# EAGLE board 8B_RAM_3 (EAGLE 6.5.0), part 1 of 3
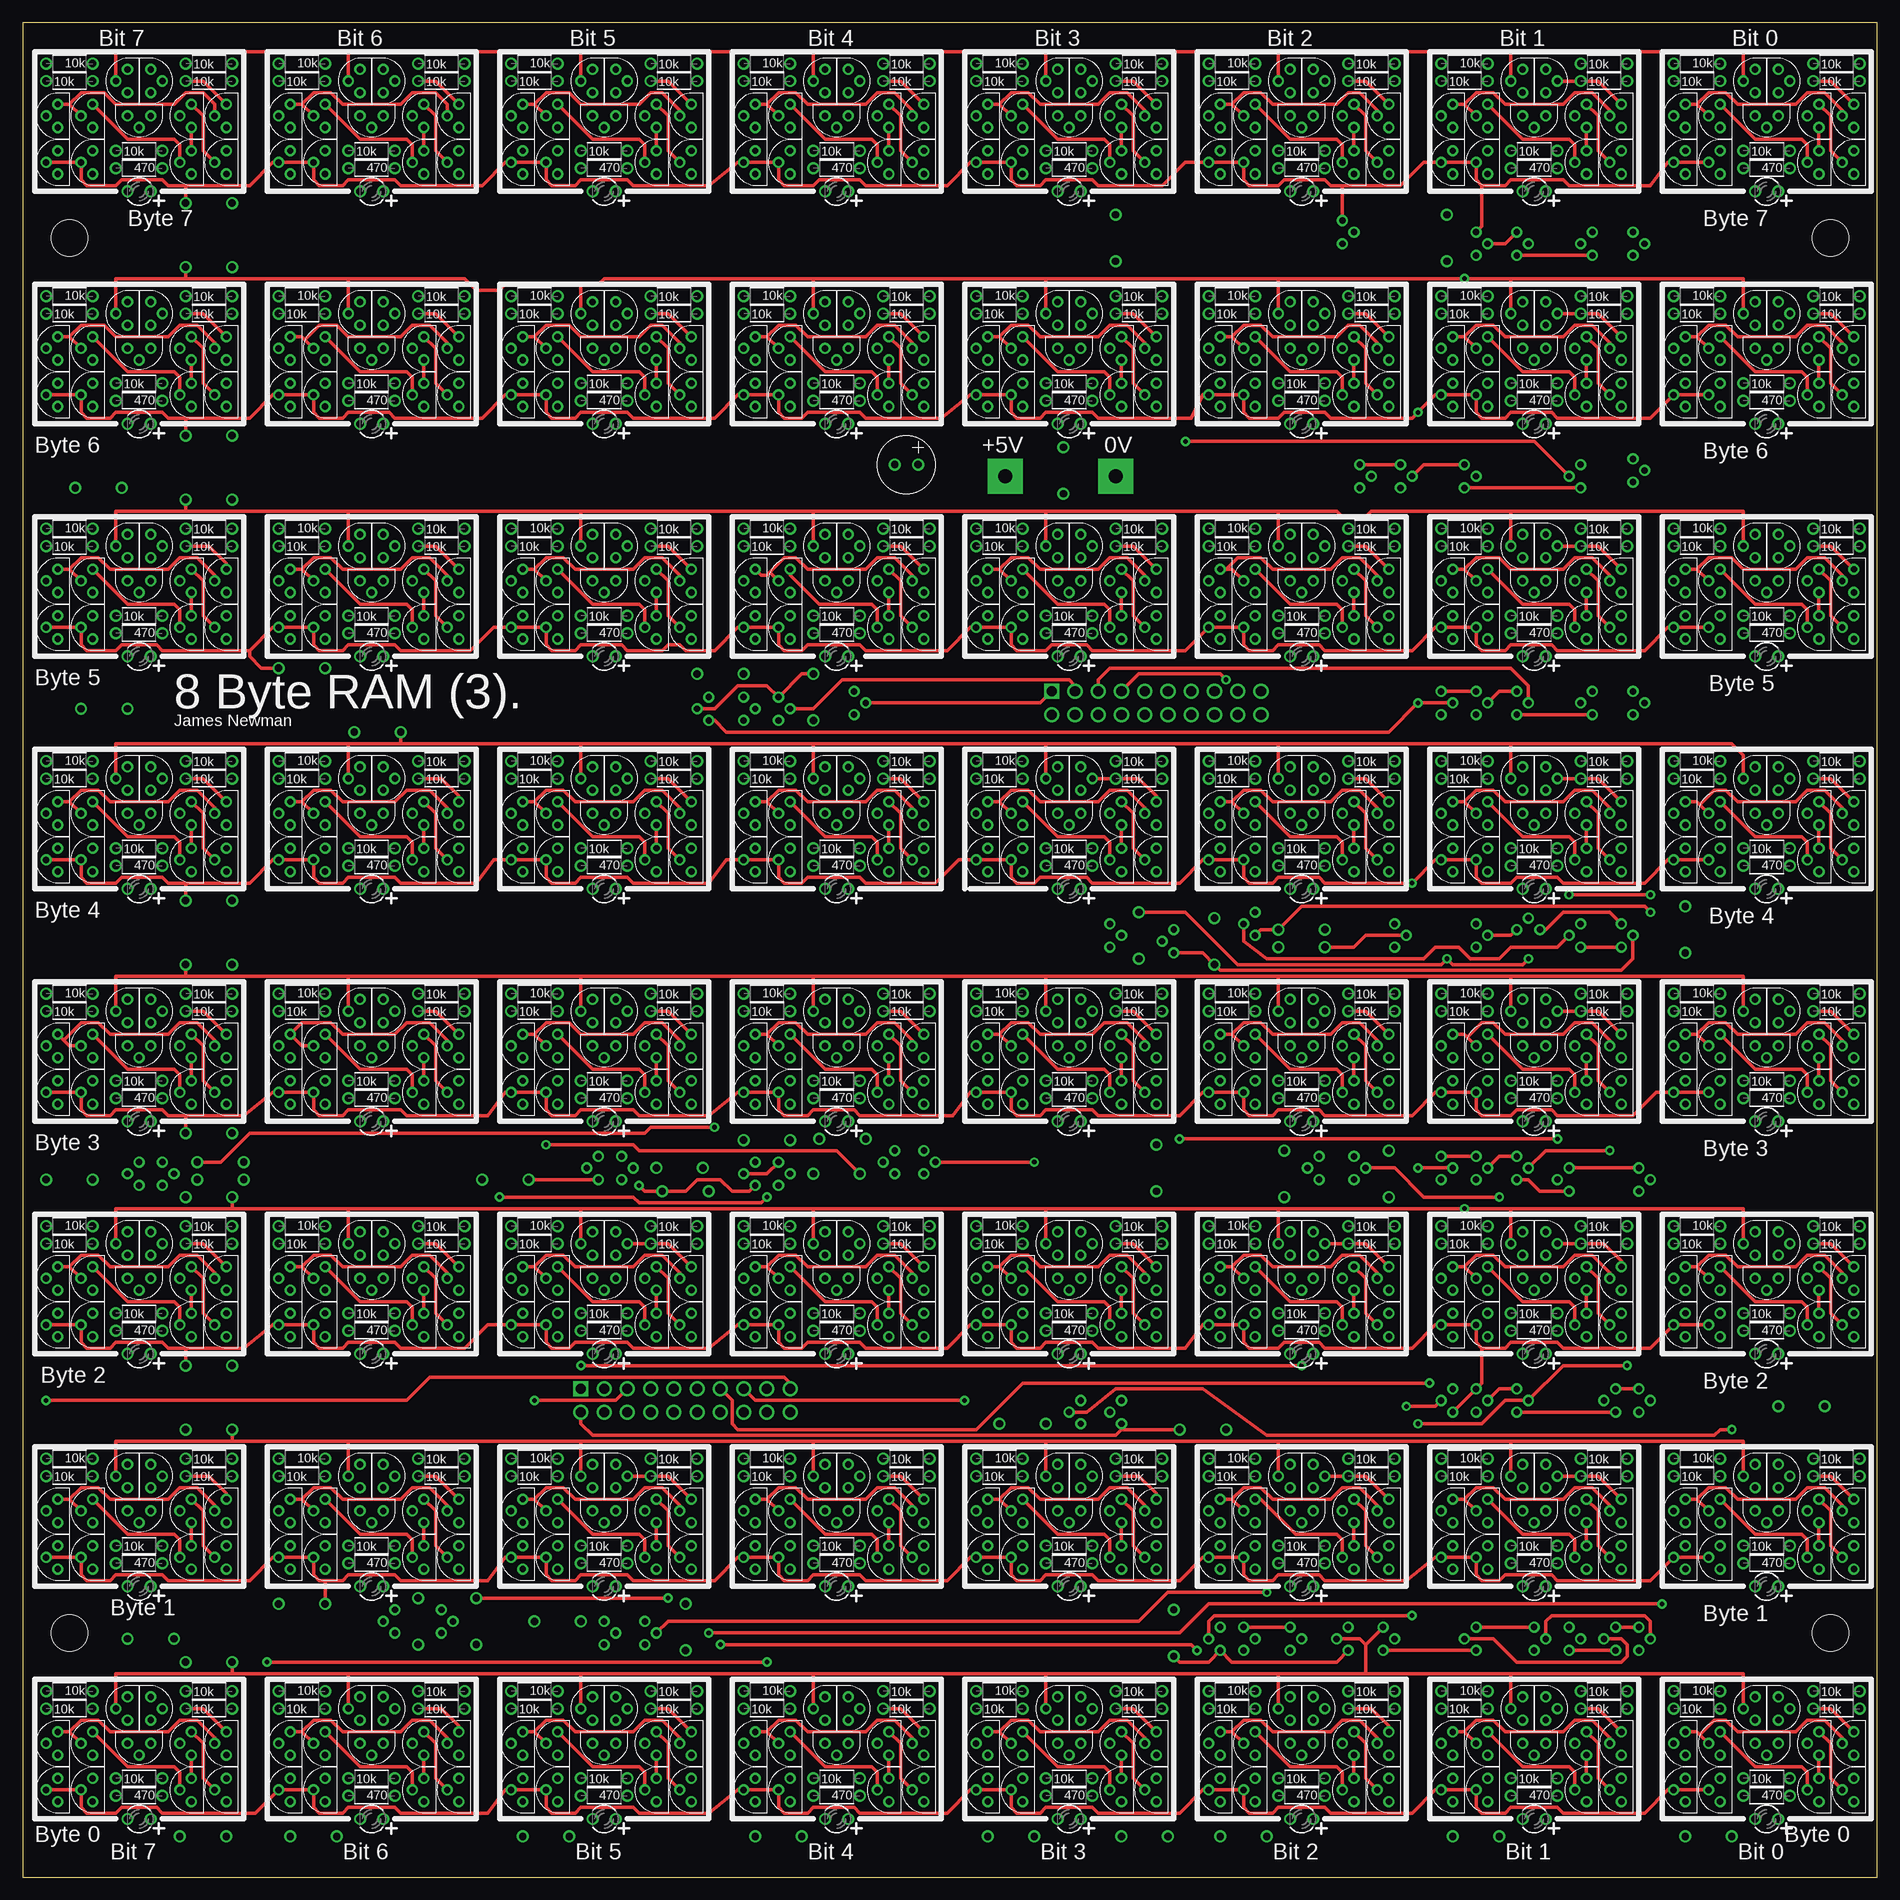
[diagram p44: board, top side]
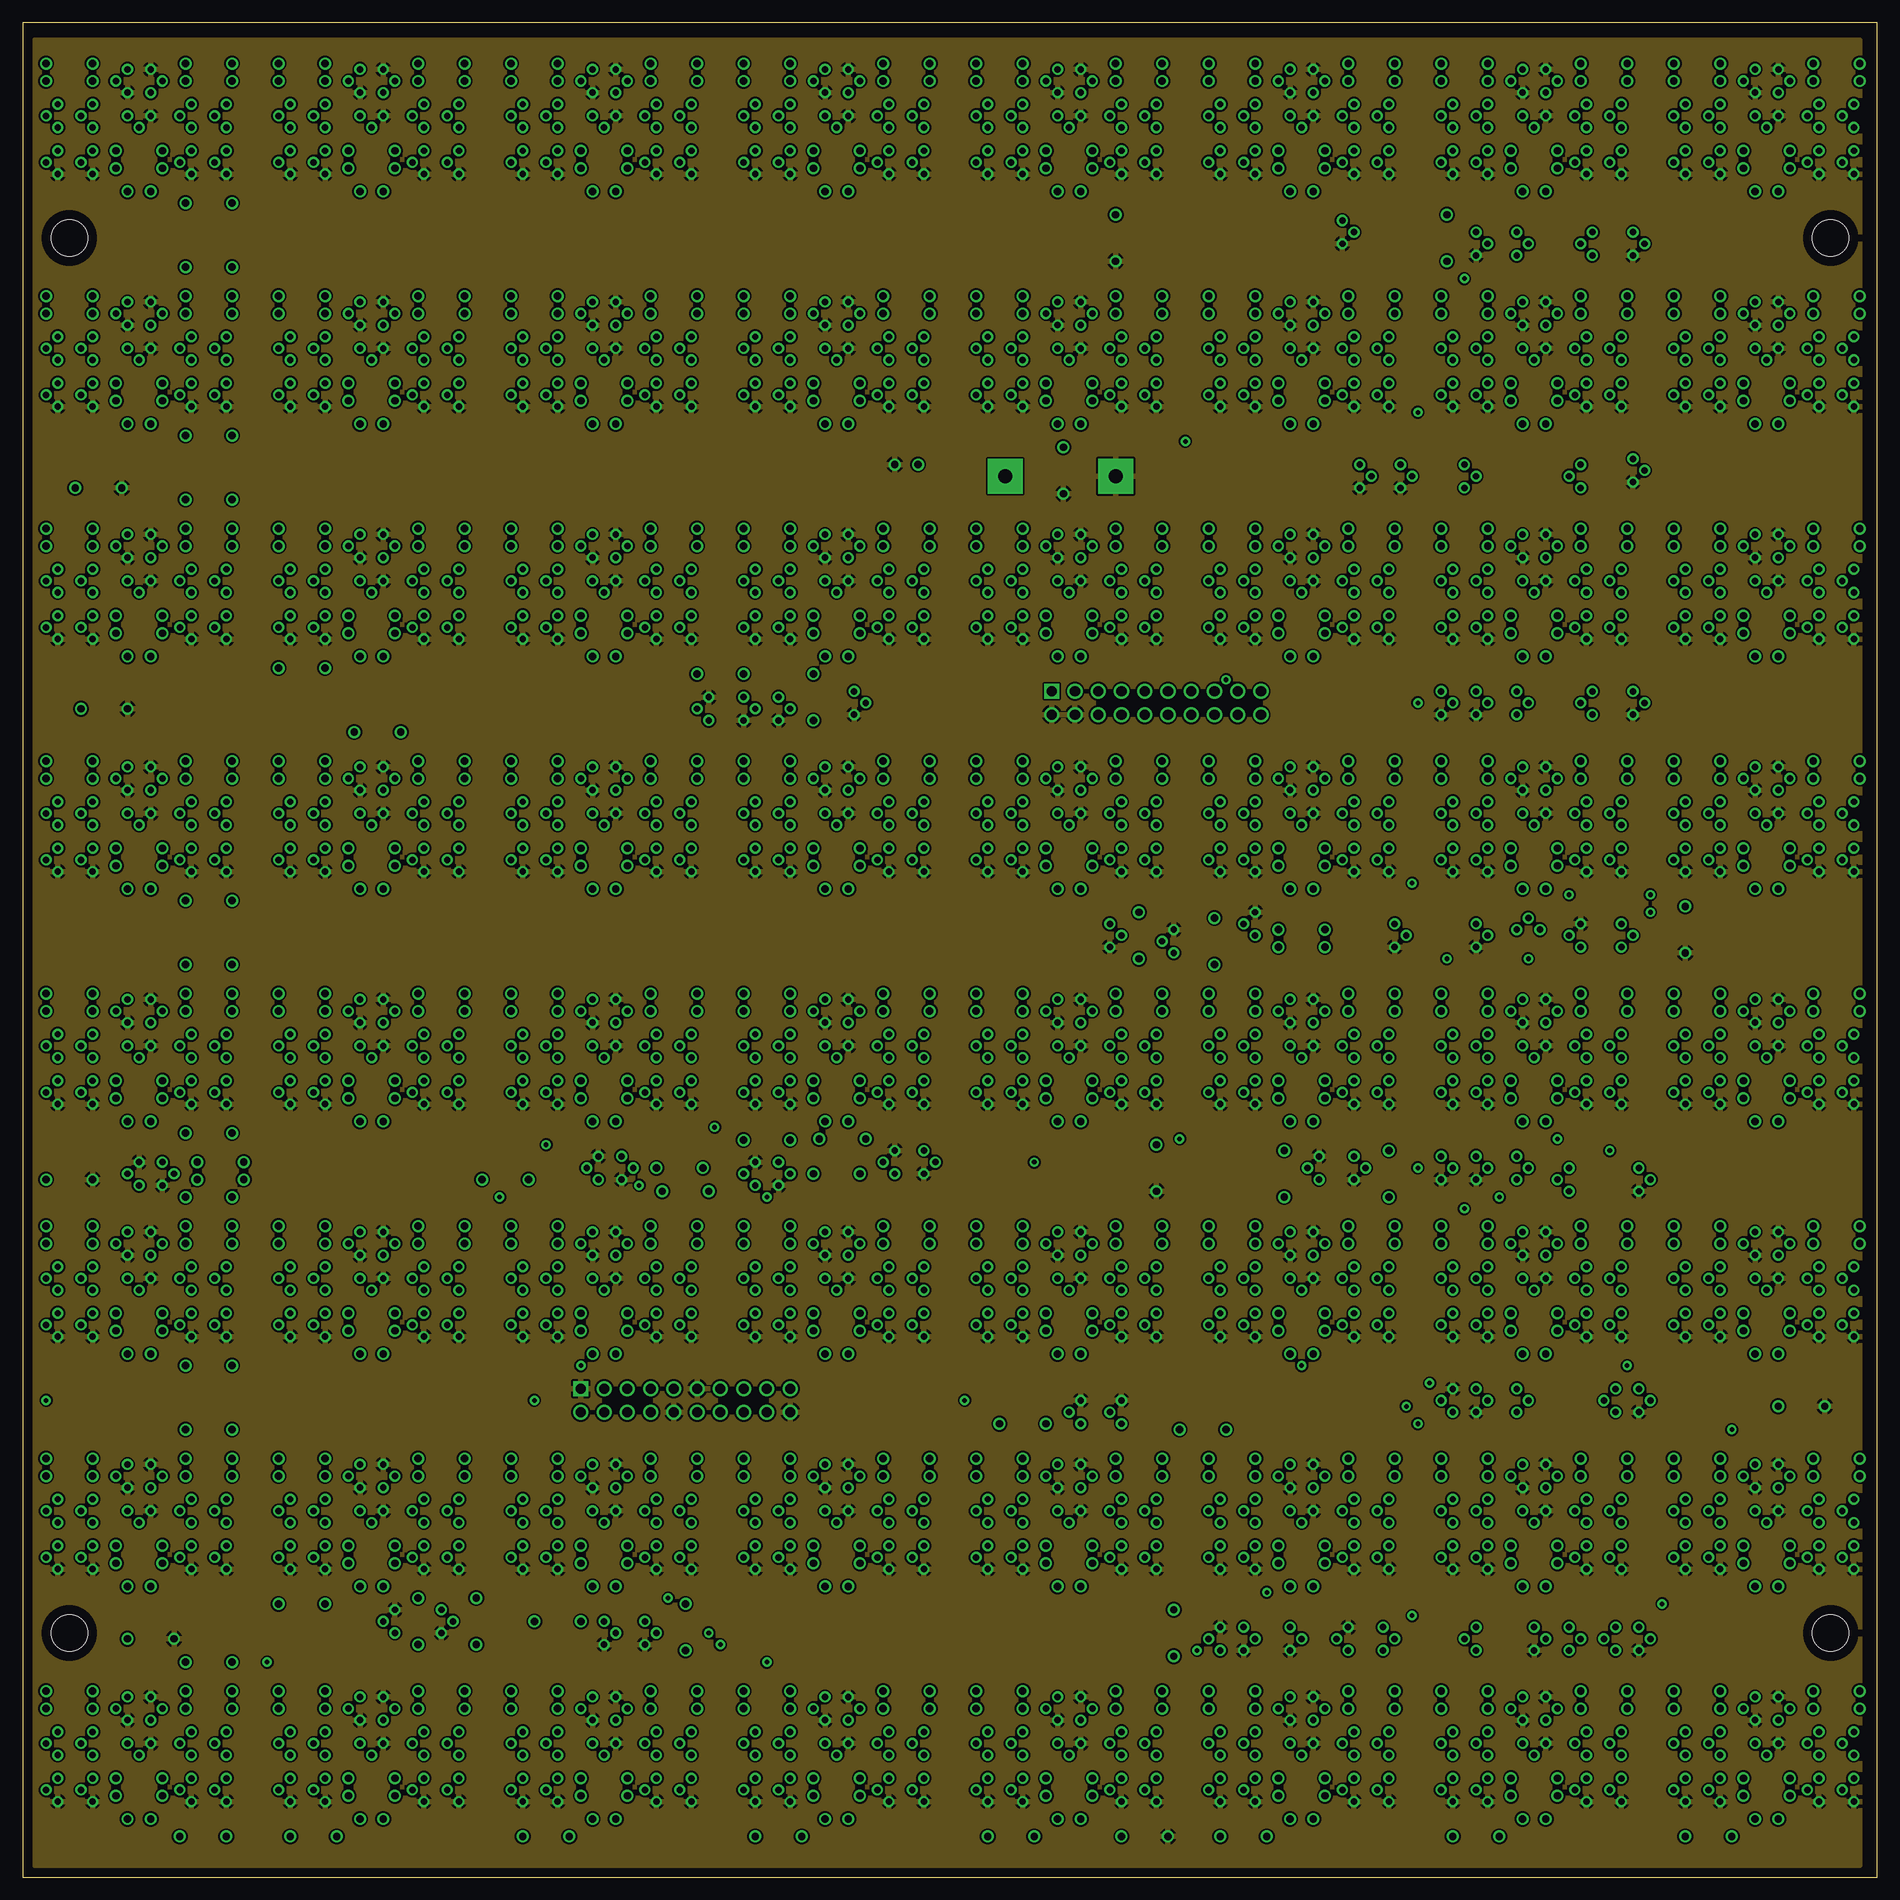
[diagram p45: board, inner layer Route2]
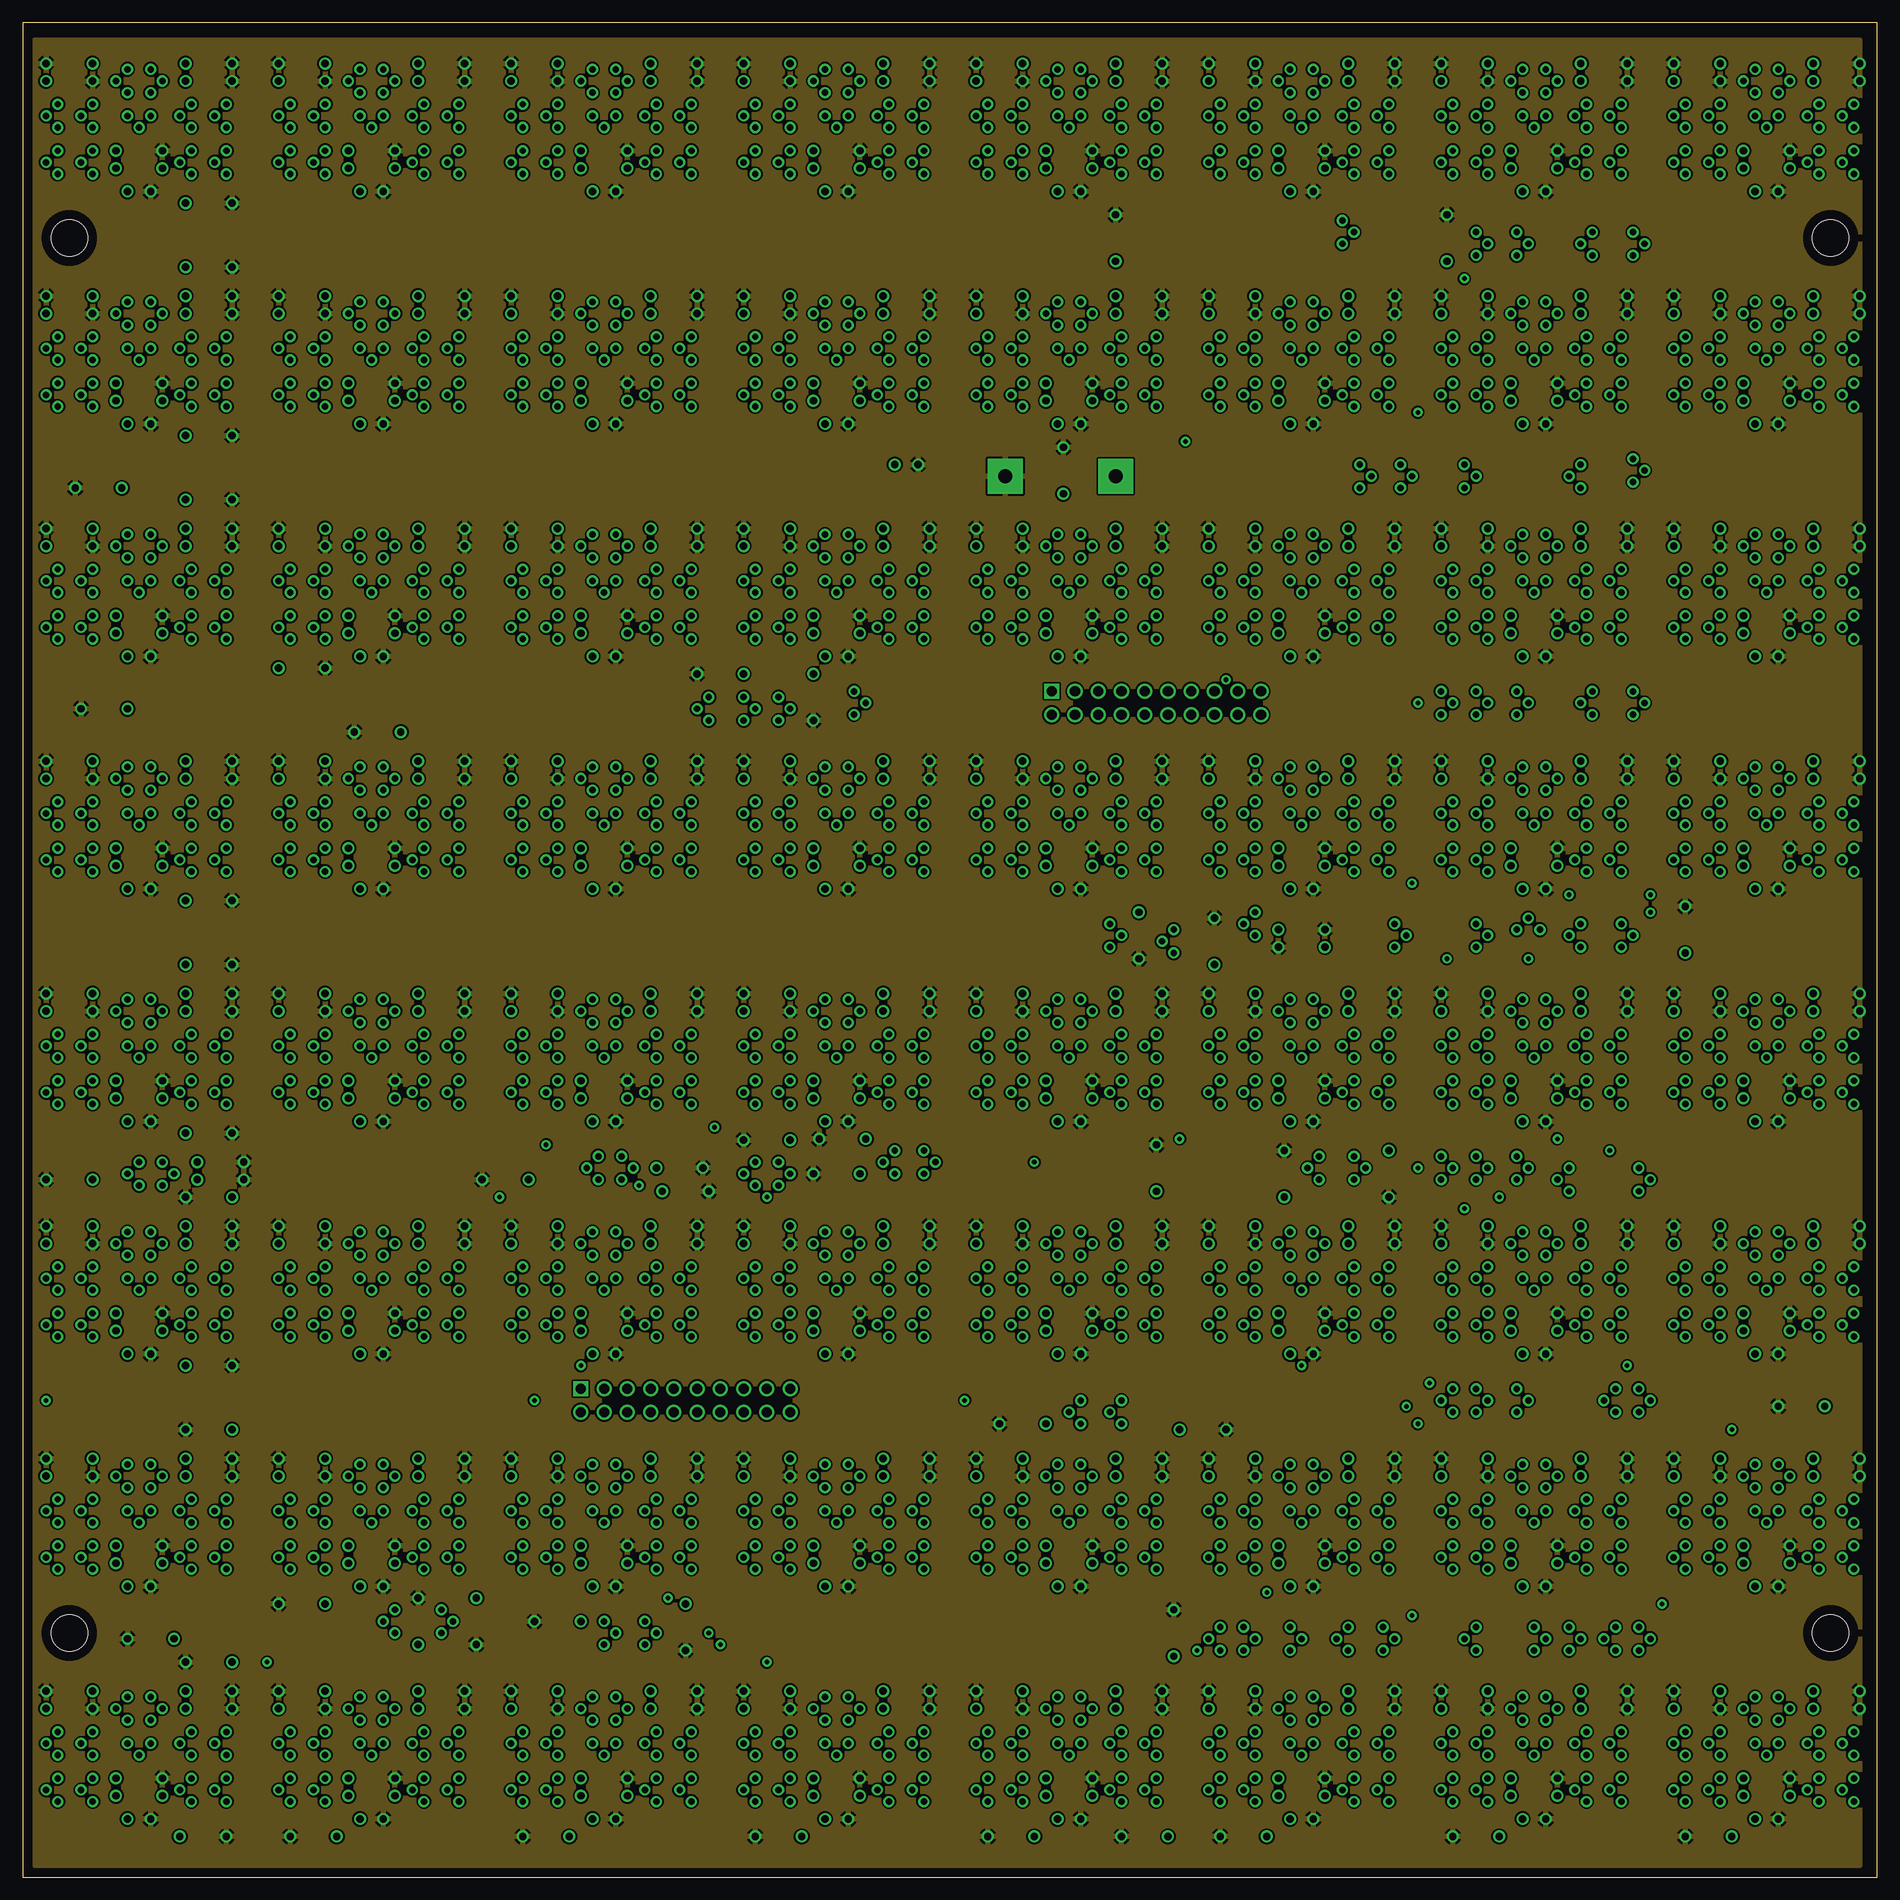
[diagram p46: board, inner layer Route3]
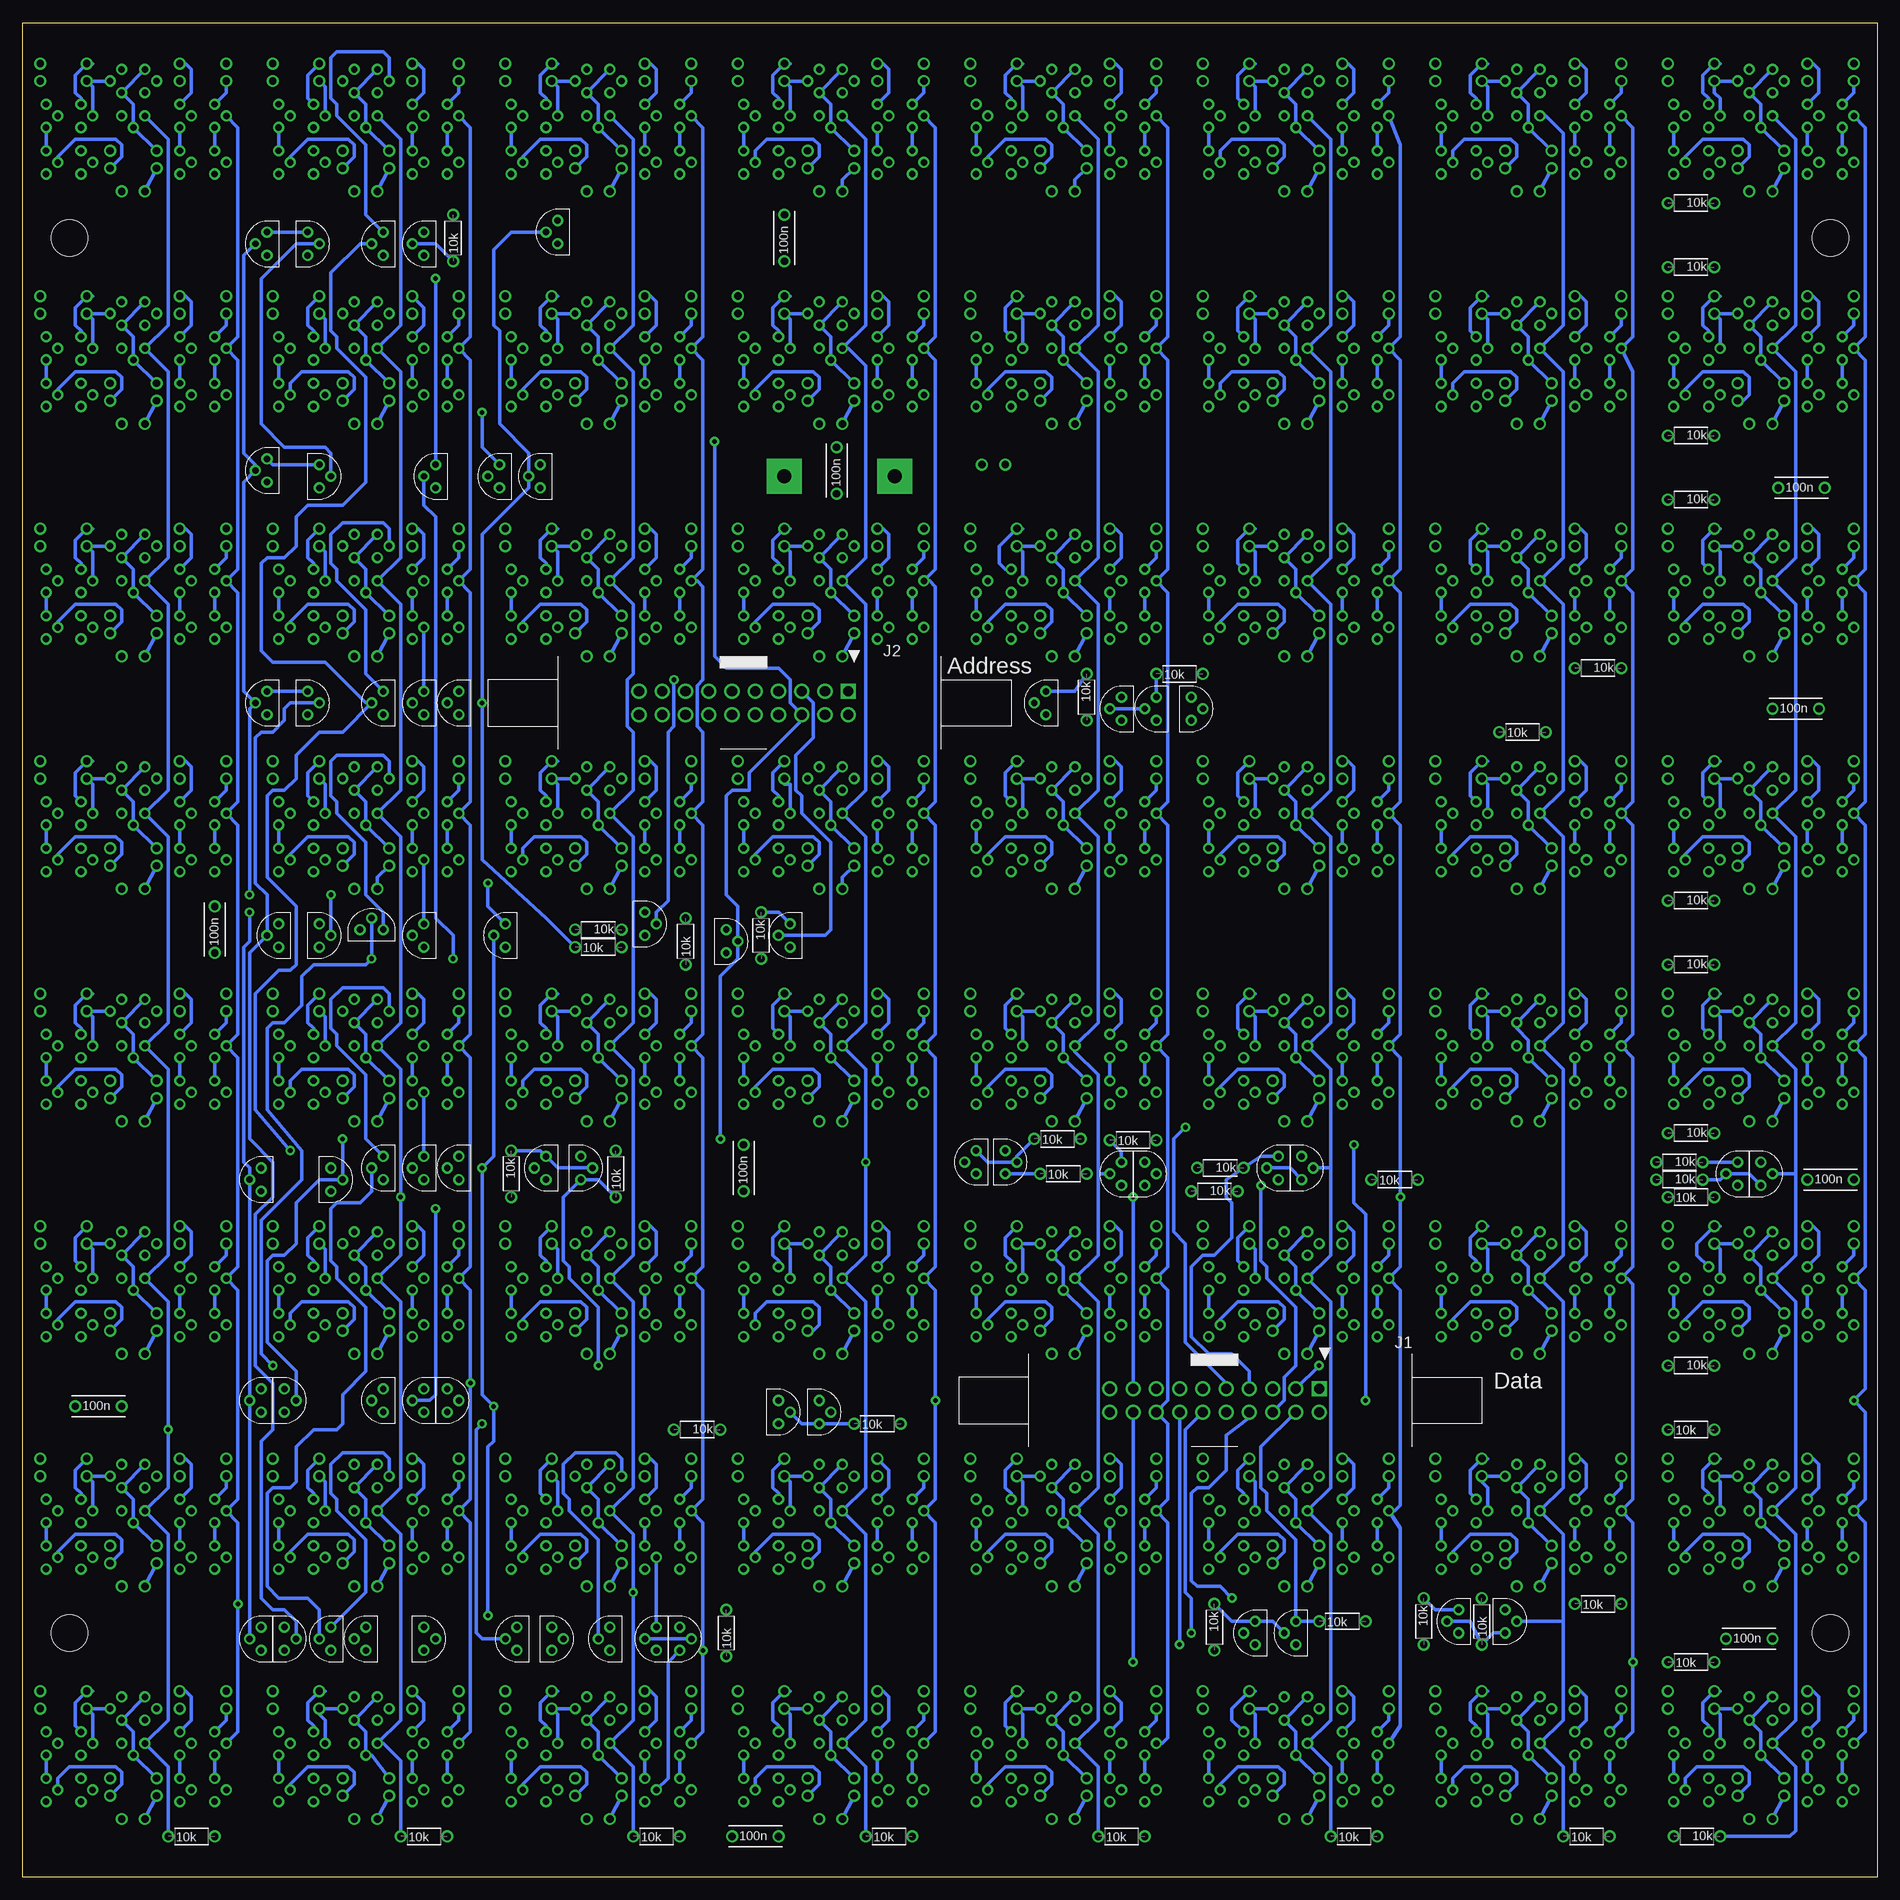
[diagram p47: board, bottom side, seen from below]

Size 202.56 x 202.56 mm. Coordinates in mm from the lower left corner, seen from the top.
Outline: 0,0 202.56,0 202.56,202.56 0,202.56 0,0
Copper layers (1*2+3*16): Top 0.035mm / dielectric 0.2mm / Route2 0.035mm / dielectric 1mm / Route3 0.035mm / dielectric 0.2mm / Bottom 0.035mm
Design rules "processor_rules_4layer": minimum track width 10mil, minimum drill 0.0236mm, track to track 8mil, track to pad 8mil, pad to pad 8mil, via to via 8mil, smd to smd 8mil, copper to edge 40mil, drill to drill 8mil, minimum pad ring 10mil, minimum via ring 8mil, stop-mask expansion 4mil, vias tented up to drill 0.7mm, thermal gap 10mil

## Footprints (pad centres in the part's own frame; a part is rotated, then mirrored left to right if it is on the bottom)
CAP_P2INCH = drill 0.8: 1 -2.54,0; 2 2.54,0
POLARISED_CAP_2P5_6P3MM = drill 0.8: A 1.27,0; K -1.27,0
LED3MM = drill 0.8: A -1.27,0; K 1.27,0
4M_HOLE = hole 4: 0,0
20_HDR_LOCKING = drill 1.1 square: 1 -1.27,11.43 | drill 1.1: 2 1.27,11.43; 3 -1.27,8.89; 4 1.27,8.89; 5 -1.27,6.35; 6 1.27,6.35; 7 -1.27,3.81; 8 1.27,3.81; 9 -1.27,1.27; 10 1.27,1.27; 11 -1.27,-1.27; 12 1.27,-1.27; 13 -1.27,-3.81; 14 1.27,-3.81; 15 -1.27,-6.35; 16 1.27,-6.35; 17 -1.27,-8.89; 18 1.27,-8.89; 19 -1.27,-11.43; 20 1.27,-11.43
POWER_PAD = drill 1.5 pad 3.81 square: 1 0,0
TO92-DGS = drill 0.7: D 0,1.27; G -1.27,0; S 0,-1.27
R_P2INCH = drill 0.8: 1 -2.54,0; 2 2.54,0

## Placement (x,y rotation side)
C1  100n  [CAP_P2INCH]  181.61,103.5 90 bottom
C2  100n  [CAP_P2INCH]  5.08,76.2 0 bottom
C3  100n  [CAP_P2INCH]  122.56,4.45 0 bottom
C4  100n  [CAP_P2INCH]  119.38,179.07 90 bottom
C5  100n  [CAP_P2INCH]  8.89,127.64 0 bottom
C6  100n  [CAP_P2INCH]  113.67,153.67 90 bottom
C7  100n  [CAP_P2INCH]  123.83,77.47 90 bottom
C8  100n  [CAP_P2INCH]  8.26,151.76 0 bottom
C9  100u  [POLARISED_CAP_2P5_6P3MM]  96.52,154.31 0 top
C10  100n  [CAP_P2INCH]  194.31,51.44 0 bottom
C11  100n  [CAP_P2INCH]  13.97,26.04 0 bottom
D1  L-1334SRT  [LED3MM]  190.5,6.35 180 top
D2  L-1334SRT  [LED3MM]  165.1,6.35 180 top
D3  L-1334SRT  [LED3MM]  190.5,31.75 180 top
D4  L-1334SRT  [LED3MM]  165.1,31.75 180 top
D5  L-1334SRT  [LED3MM]  139.7,6.35 180 top
D6  L-1334SRT  [LED3MM]  114.3,6.35 180 top
D7  L-1334SRT  [LED3MM]  88.9,6.35 180 top
D8  L-1334SRT  [LED3MM]  63.5,6.35 180 top
D9  L-1334SRT  [LED3MM]  38.1,6.35 180 top
D10  L-1334SRT  [LED3MM]  12.7,6.35 180 top
D11  L-1334SRT  [LED3MM]  139.7,31.75 180 top
D12  L-1334SRT  [LED3MM]  114.3,31.75 180 top
D13  L-1334SRT  [LED3MM]  88.9,31.75 180 top
D14  L-1334SRT  [LED3MM]  63.5,31.75 180 top
D15  L-1334SRT  [LED3MM]  38.1,31.75 180 top
D16  L-1334SRT  [LED3MM]  12.7,31.75 180 top
D17  L-1334SRT  [LED3MM]  190.5,57.15 180 top
D18  L-1334SRT  [LED3MM]  165.1,57.15 180 top
D19  L-1334SRT  [LED3MM]  139.7,57.15 180 top
D20  L-1334SRT  [LED3MM]  114.3,57.15 180 top
D21  L-1334SRT  [LED3MM]  88.9,57.15 180 top
D22  L-1334SRT  [LED3MM]  63.5,57.15 180 top
D23  L-1334SRT  [LED3MM]  38.1,57.15 180 top
D24  L-1334SRT  [LED3MM]  12.7,57.15 180 top
D25  L-1334SRT  [LED3MM]  190.5,82.55 180 top
D26  L-1334SRT  [LED3MM]  165.1,82.55 180 top
D27  L-1334SRT  [LED3MM]  139.7,82.55 180 top
D28  L-1334SRT  [LED3MM]  114.3,82.55 180 top
D29  L-1334SRT  [LED3MM]  88.9,82.55 180 top
D30  L-1334SRT  [LED3MM]  63.5,82.55 180 top
D31  L-1334SRT  [LED3MM]  38.1,82.55 180 top
D32  L-1334SRT  [LED3MM]  12.7,82.55 180 top
D33  L-1334SRT  [LED3MM]  190.5,107.95 180 top
D34  L-1334SRT  [LED3MM]  165.1,107.95 180 top
D35  L-1334SRT  [LED3MM]  139.7,107.95 180 top
D36  L-1334SRT  [LED3MM]  114.3,107.95 180 top
D37  L-1334SRT  [LED3MM]  88.9,107.95 180 top
D38  L-1334SRT  [LED3MM]  63.5,107.95 180 top
D39  L-1334SRT  [LED3MM]  38.1,107.95 180 top
D40  L-1334SRT  [LED3MM]  12.7,107.95 180 top
D41  L-1334SRT  [LED3MM]  190.5,133.35 180 top
D42  L-1334SRT  [LED3MM]  165.1,133.35 180 top
D43  L-1334SRT  [LED3MM]  139.7,133.35 180 top
D44  L-1334SRT  [LED3MM]  114.3,133.35 180 top
D45  L-1334SRT  [LED3MM]  88.9,133.35 180 top
D46  L-1334SRT  [LED3MM]  63.5,133.35 180 top
D47  L-1334SRT  [LED3MM]  38.1,133.35 180 top
D48  L-1334SRT  [LED3MM]  12.7,133.35 180 top
D49  L-1334SRT  [LED3MM]  190.5,158.75 180 top
D50  L-1334SRT  [LED3MM]  165.1,158.75 180 top
D51  L-1334SRT  [LED3MM]  139.7,158.75 180 top
D52  L-1334SRT  [LED3MM]  114.3,158.75 180 top
D53  L-1334SRT  [LED3MM]  88.9,158.75 180 top
D54  L-1334SRT  [LED3MM]  63.5,158.75 180 top
D55  L-1334SRT  [LED3MM]  38.1,158.75 180 top
D56  L-1334SRT  [LED3MM]  12.7,158.75 180 top
D57  L-1334SRT  [LED3MM]  190.5,184.15 180 top
D58  L-1334SRT  [LED3MM]  165.1,184.15 180 top
D59  L-1334SRT  [LED3MM]  139.7,184.15 180 top
D60  L-1334SRT  [LED3MM]  114.3,184.15 180 top
D61  L-1334SRT  [LED3MM]  88.9,184.15 180 top
D62  L-1334SRT  [LED3MM]  63.5,184.15 180 top
D63  L-1334SRT  [LED3MM]  38.1,184.15 180 top
D64  L-1334SRT  [LED3MM]  12.7,184.15 180 top
H1  4M_MOUNT_HOLE  [4M_HOLE]  197.49,26.67 0 top
H2  4M_MOUNT_HOLE  [4M_HOLE]  5.08,179.07 0 top
H3  4M_MOUNT_HOLE  [4M_HOLE]  197.49,179.07 0 top
H4  4M_MOUNT_HOLE  [4M_HOLE]  5.08,26.67 0 top
J1  20_HDR_LOCKING  [20_HDR_LOCKING]  72.39,52.07 270 bottom
J2  20_HDR_LOCKING  [20_HDR_LOCKING]  123.83,128.27 270 bottom
PP1  POWER_PAD  [POWER_PAD]  119.38,153.03 90 top
PP2  POWER_PAD  [POWER_PAD]  107.31,153.03 90 top
Q1  2N7000  [TO92-DGS]  181.61,9.53 0 top
Q2  2N7000  [TO92-DGS]  181.61,14.61 0 top
Q3  2N7000  [TO92-DGS]  185.42,9.53 0 top
Q4  2N7000  [TO92-DGS]  185.42,14.61 0 top
Q5  2N7000  [TO92-DGS]  200.03,9.53 0 top
Q6  2N7000  [TO92-DGS]  200.03,14.61 0 top
Q7  2N7000  [TO92-DGS]  196.22,9.53 0 top
Q8  2N7000  [TO92-DGS]  196.22,14.61 0 top
Q9  2N7000  [TO92-DGS]  156.21,9.53 0 top
Q10  2N7000  [TO92-DGS]  156.21,14.61 0 top
Q11  2N7000  [TO92-DGS]  160.02,9.53 0 top
Q12  2N7000  [TO92-DGS]  160.02,14.61 0 top
Q13  2N7000  [TO92-DGS]  174.62,9.53 0 top
Q14  2N7000  [TO92-DGS]  174.62,14.61 0 top
Q15  2N7000  [TO92-DGS]  170.81,9.53 0 top
Q16  2N7000  [TO92-DGS]  170.81,14.61 0 top
Q17  2N7000  [TO92-DGS]  191.77,18.41 180 top
Q18  2N7000  [TO92-DGS]  166.37,18.41 180 top
Q19  2N7000  [TO92-DGS]  181.61,34.92 0 top
Q20  2N7000  [TO92-DGS]  181.61,40.01 0 top
Q21  2N7000  [TO92-DGS]  185.42,34.92 0 top
Q22  2N7000  [TO92-DGS]  185.42,40.01 0 top
Q23  2N7000  [TO92-DGS]  200.03,34.92 0 top
Q24  2N7000  [TO92-DGS]  200.03,40.01 0 top
Q25  2N7000  [TO92-DGS]  196.22,40.01 0 top
Q26  2N7000  [TO92-DGS]  196.22,34.92 0 top
Q27  2N7000  [TO92-DGS]  156.21,34.92 0 top
Q28  2N7000  [TO92-DGS]  156.21,40.01 0 top
Q29  2N7000  [TO92-DGS]  160.02,34.92 0 top
Q30  2N7000  [TO92-DGS]  160.02,40.01 0 top
Q31  2N7000  [TO92-DGS]  174.62,34.92 0 top
Q32  2N7000  [TO92-DGS]  174.62,40.01 0 top
Q33  2N7000  [TO92-DGS]  170.81,40.01 0 top
Q34  2N7000  [TO92-DGS]  170.81,34.92 0 top
Q35  2N7000  [TO92-DGS]  191.77,43.81 180 top
Q36  2N7000  [TO92-DGS]  166.37,43.81 180 top
Q37  2N7000  [TO92-DGS]  130.81,9.53 0 top
Q38  2N7000  [TO92-DGS]  130.81,14.61 0 top
Q39  2N7000  [TO92-DGS]  134.62,9.53 0 top
Q40  2N7000  [TO92-DGS]  134.62,14.61 0 top
Q41  2N7000  [TO92-DGS]  149.22,9.53 0 top
Q42  2N7000  [TO92-DGS]  149.22,14.61 0 top
Q43  2N7000  [TO92-DGS]  145.41,14.61 0 top
Q44  2N7000  [TO92-DGS]  145.41,9.53 0 top
Q45  2N7000  [TO92-DGS]  105.41,9.53 0 top
Q46  2N7000  [TO92-DGS]  105.41,14.61 0 top
Q47  2N7000  [TO92-DGS]  109.22,9.53 0 top
Q48  2N7000  [TO92-DGS]  109.22,14.61 0 top
Q49  2N7000  [TO92-DGS]  123.83,9.53 0 top
Q50  2N7000  [TO92-DGS]  123.83,14.61 0 top
Q51  2N7000  [TO92-DGS]  120.02,14.61 0 top
Q52  2N7000  [TO92-DGS]  120.02,9.53 0 top
Q53  2N7000  [TO92-DGS]  140.97,18.41 180 top
Q54  2N7000  [TO92-DGS]  115.57,18.41 180 top
Q55  2N7000  [TO92-DGS]  80.01,9.53 0 top
Q56  2N7000  [TO92-DGS]  80.01,14.61 0 top
Q57  2N7000  [TO92-DGS]  83.82,9.53 0 top
Q58  2N7000  [TO92-DGS]  83.82,14.61 0 top
Q59  2N7000  [TO92-DGS]  98.42,9.53 0 top
Q60  2N7000  [TO92-DGS]  98.42,14.61 0 top
Q61  2N7000  [TO92-DGS]  94.61,14.61 0 top
Q62  2N7000  [TO92-DGS]  94.61,9.53 0 top
Q63  2N7000  [TO92-DGS]  54.61,9.53 0 top
Q64  2N7000  [TO92-DGS]  54.61,14.61 0 top
Q65  2N7000  [TO92-DGS]  58.42,9.53 0 top
Q66  2N7000  [TO92-DGS]  58.42,14.61 0 top
Q67  2N7000  [TO92-DGS]  73.03,9.53 0 top
Q68  2N7000  [TO92-DGS]  73.03,14.61 0 top
Q69  2N7000  [TO92-DGS]  69.22,14.61 0 top
Q70  2N7000  [TO92-DGS]  69.22,9.53 0 top
Q71  2N7000  [TO92-DGS]  90.17,18.41 180 top
Q72  2N7000  [TO92-DGS]  64.77,18.41 180 top
Q73  2N7000  [TO92-DGS]  29.21,9.53 0 top
Q74  2N7000  [TO92-DGS]  29.21,14.61 0 top
Q75  2N7000  [TO92-DGS]  33.02,9.53 0 top
Q76  2N7000  [TO92-DGS]  33.02,14.61 0 top
Q77  2N7000  [TO92-DGS]  47.62,9.53 0 top
Q78  2N7000  [TO92-DGS]  47.62,14.61 0 top
Q79  2N7000  [TO92-DGS]  43.81,14.61 0 top
Q80  2N7000  [TO92-DGS]  43.81,9.53 0 top
Q81  2N7000  [TO92-DGS]  3.81,9.53 0 top
Q82  2N7000  [TO92-DGS]  3.81,14.61 0 top
Q83  2N7000  [TO92-DGS]  7.62,9.53 0 top
Q84  2N7000  [TO92-DGS]  7.62,14.61 0 top
Q85  2N7000  [TO92-DGS]  22.23,9.53 0 top
Q86  2N7000  [TO92-DGS]  22.23,14.61 0 top
Q87  2N7000  [TO92-DGS]  18.41,14.61 0 top
Q88  2N7000  [TO92-DGS]  18.41,9.53 0 top
Q89  2N7000  [TO92-DGS]  39.37,18.41 180 top
Q90  2N7000  [TO92-DGS]  13.97,18.41 180 top
Q91  2N7000  [TO92-DGS]  130.81,34.92 0 top
Q92  2N7000  [TO92-DGS]  130.81,40.01 0 top
Q93  2N7000  [TO92-DGS]  134.62,34.92 0 top
Q94  2N7000  [TO92-DGS]  134.62,40.01 0 top
Q95  2N7000  [TO92-DGS]  149.22,34.92 0 top
Q96  2N7000  [TO92-DGS]  149.22,40.01 0 top
Q97  2N7000  [TO92-DGS]  145.41,40.01 0 top
Q98  2N7000  [TO92-DGS]  145.41,34.92 0 top
Q99  2N7000  [TO92-DGS]  105.41,34.92 0 top
Q100  2N7000  [TO92-DGS]  105.41,40.01 0 top
Q101  2N7000  [TO92-DGS]  109.22,34.92 0 top
Q102  2N7000  [TO92-DGS]  109.22,40.01 0 top
Q103  2N7000  [TO92-DGS]  123.83,34.92 0 top
Q104  2N7000  [TO92-DGS]  123.83,40.01 0 top
Q105  2N7000  [TO92-DGS]  120.02,40.01 0 top
Q106  2N7000  [TO92-DGS]  120.02,34.92 0 top
Q107  2N7000  [TO92-DGS]  140.97,43.81 180 top
Q108  2N7000  [TO92-DGS]  115.57,43.81 180 top
Q109  2N7000  [TO92-DGS]  80.01,34.92 0 top
Q110  2N7000  [TO92-DGS]  80.01,40.01 0 top
Q111  2N7000  [TO92-DGS]  83.82,34.92 0 top
Q112  2N7000  [TO92-DGS]  83.82,40.01 0 top
Q113  2N7000  [TO92-DGS]  98.42,34.92 0 top
Q114  2N7000  [TO92-DGS]  98.42,40.01 0 top
Q115  2N7000  [TO92-DGS]  94.61,40.01 0 top
Q116  2N7000  [TO92-DGS]  94.61,34.92 0 top
Q117  2N7000  [TO92-DGS]  54.61,34.92 0 top
Q118  2N7000  [TO92-DGS]  54.61,40.01 0 top
Q119  2N7000  [TO92-DGS]  58.42,34.92 0 top
Q120  2N7000  [TO92-DGS]  58.42,40.01 0 top
Q121  2N7000  [TO92-DGS]  73.03,34.92 0 top
Q122  2N7000  [TO92-DGS]  73.03,40.01 0 top
Q123  2N7000  [TO92-DGS]  69.22,40.01 0 top
Q124  2N7000  [TO92-DGS]  69.22,34.92 0 top
Q125  2N7000  [TO92-DGS]  90.17,43.81 180 top
Q126  2N7000  [TO92-DGS]  64.77,43.81 180 top
Q127  2N7000  [TO92-DGS]  29.21,34.92 0 top
Q128  2N7000  [TO92-DGS]  29.21,40.01 0 top
Q129  2N7000  [TO92-DGS]  33.02,34.92 0 top
Q130  2N7000  [TO92-DGS]  33.02,40.01 0 top
Q131  2N7000  [TO92-DGS]  47.62,34.92 0 top
Q132  2N7000  [TO92-DGS]  47.62,40.01 0 top
Q133  2N7000  [TO92-DGS]  43.81,40.01 0 top
Q134  2N7000  [TO92-DGS]  43.81,34.92 0 top
Q135  2N7000  [TO92-DGS]  3.81,34.92 0 top
Q136  2N7000  [TO92-DGS]  3.81,40.01 0 top
Q137  2N7000  [TO92-DGS]  7.62,34.92 0 top
Q138  2N7000  [TO92-DGS]  7.62,40.01 0 top
Q139  2N7000  [TO92-DGS]  22.23,34.92 0 top
Q140  2N7000  [TO92-DGS]  22.23,40.01 0 top
Q141  2N7000  [TO92-DGS]  18.41,40.01 0 top
Q142  2N7000  [TO92-DGS]  18.41,34.92 0 top
Q143  2N7000  [TO92-DGS]  39.37,43.81 180 top
Q144  2N7000  [TO92-DGS]  13.97,43.81 180 top
Q145  2N7000  [TO92-DGS]  181.61,60.33 0 top
Q146  2N7000  [TO92-DGS]  181.61,65.41 0 top
Q147  2N7000  [TO92-DGS]  185.42,60.33 0 top
Q148  2N7000  [TO92-DGS]  185.42,65.41 0 top
Q149  2N7000  [TO92-DGS]  200.03,60.33 0 top
Q150  2N7000  [TO92-DGS]  200.03,65.41 0 top
Q151  2N7000  [TO92-DGS]  196.22,65.41 0 top
Q152  2N7000  [TO92-DGS]  196.22,60.33 0 top
Q153  2N7000  [TO92-DGS]  156.21,60.33 0 top
Q154  2N7000  [TO92-DGS]  156.21,65.41 0 top
Q155  2N7000  [TO92-DGS]  160.02,60.33 0 top
Q156  2N7000  [TO92-DGS]  160.02,65.41 0 top
Q157  2N7000  [TO92-DGS]  174.62,60.33 0 top
Q158  2N7000  [TO92-DGS]  174.62,65.41 0 top
Q159  2N7000  [TO92-DGS]  170.81,65.41 0 top
Q160  2N7000  [TO92-DGS]  170.81,60.33 0 top
Q161  2N7000  [TO92-DGS]  191.77,69.22 180 top
Q162  2N7000  [TO92-DGS]  166.37,69.22 180 top
Q163  2N7000  [TO92-DGS]  130.81,60.33 0 top
Q164  2N7000  [TO92-DGS]  130.81,65.41 0 top
Q165  2N7000  [TO92-DGS]  134.62,60.33 0 top
Q166  2N7000  [TO92-DGS]  134.62,65.41 0 top
Q167  2N7000  [TO92-DGS]  149.22,60.33 0 top
Q168  2N7000  [TO92-DGS]  149.22,65.41 0 top
Q169  2N7000  [TO92-DGS]  145.41,65.41 0 top
Q170  2N7000  [TO92-DGS]  145.41,60.33 0 top
Q171  2N7000  [TO92-DGS]  105.41,60.33 0 top
Q172  2N7000  [TO92-DGS]  105.41,65.41 0 top
Q173  2N7000  [TO92-DGS]  109.22,60.33 0 top
Q174  2N7000  [TO92-DGS]  109.22,65.41 0 top
Q175  2N7000  [TO92-DGS]  123.83,60.33 0 top
Q176  2N7000  [TO92-DGS]  123.83,65.41 0 top
Q177  2N7000  [TO92-DGS]  120.02,65.41 0 top
Q178  2N7000  [TO92-DGS]  120.02,60.33 0 top
Q179  2N7000  [TO92-DGS]  140.97,69.22 180 top
Q180  2N7000  [TO92-DGS]  115.57,69.22 180 top
Q181  2N7000  [TO92-DGS]  80.01,60.33 0 top
Q182  2N7000  [TO92-DGS]  80.01,65.41 0 top
Q183  2N7000  [TO92-DGS]  83.82,60.33 0 top
Q184  2N7000  [TO92-DGS]  83.82,65.41 0 top
Q185  2N7000  [TO92-DGS]  98.42,60.33 0 top
Q186  2N7000  [TO92-DGS]  98.42,65.41 0 top
Q187  2N7000  [TO92-DGS]  94.61,65.41 0 top
Q188  2N7000  [TO92-DGS]  94.61,60.33 0 top
Q189  2N7000  [TO92-DGS]  54.61,60.33 0 top
Q190  2N7000  [TO92-DGS]  54.61,65.41 0 top
Q191  2N7000  [TO92-DGS]  58.42,60.33 0 top
Q192  2N7000  [TO92-DGS]  58.42,65.41 0 top
Q193  2N7000  [TO92-DGS]  73.03,60.33 0 top
Q194  2N7000  [TO92-DGS]  73.03,65.41 0 top
Q195  2N7000  [TO92-DGS]  69.22,65.41 0 top
Q196  2N7000  [TO92-DGS]  69.22,60.33 0 top
Q197  2N7000  [TO92-DGS]  90.17,69.22 180 top
Q198  2N7000  [TO92-DGS]  64.77,69.22 180 top
Q199  2N7000  [TO92-DGS]  29.21,60.33 0 top
Q200  2N7000  [TO92-DGS]  29.21,65.41 0 top
Q201  2N7000  [TO92-DGS]  33.02,60.33 0 top
Q202  2N7000  [TO92-DGS]  33.02,65.41 0 top
Q203  2N7000  [TO92-DGS]  47.62,60.33 0 top
Q204  2N7000  [TO92-DGS]  47.62,65.41 0 top
Q205  2N7000  [TO92-DGS]  43.81,65.41 0 top
Q206  2N7000  [TO92-DGS]  43.81,60.33 0 top
Q207  2N7000  [TO92-DGS]  3.81,60.33 0 top
Q208  2N7000  [TO92-DGS]  3.81,65.41 0 top
Q209  2N7000  [TO92-DGS]  7.62,60.33 0 top
Q210  2N7000  [TO92-DGS]  7.62,65.41 0 top
Q211  2N7000  [TO92-DGS]  22.23,60.33 0 top
Q212  2N7000  [TO92-DGS]  22.23,65.41 0 top
Q213  2N7000  [TO92-DGS]  18.41,65.41 0 top
Q214  2N7000  [TO92-DGS]  18.41,60.33 0 top
Q215  2N7000  [TO92-DGS]  39.37,69.22 180 top
Q216  2N7000  [TO92-DGS]  13.97,69.22 180 top
Q217  2N7000  [TO92-DGS]  181.61,85.72 0 top
Q218  2N7000  [TO92-DGS]  181.61,90.81 0 top
Q219  2N7000  [TO92-DGS]  185.42,85.72 0 top
Q220  2N7000  [TO92-DGS]  185.42,90.81 0 top
Q221  2N7000  [TO92-DGS]  200.03,85.72 0 top
Q222  2N7000  [TO92-DGS]  200.03,90.81 0 top
Q223  2N7000  [TO92-DGS]  196.22,90.81 0 top
Q224  2N7000  [TO92-DGS]  196.22,85.72 0 top
Q225  2N7000  [TO92-DGS]  156.21,85.72 0 top
Q226  2N7000  [TO92-DGS]  156.21,90.81 0 top
Q227  2N7000  [TO92-DGS]  160.02,85.72 0 top
Q228  2N7000  [TO92-DGS]  160.02,90.81 0 top
Q229  2N7000  [TO92-DGS]  174.62,85.72 0 top
Q230  2N7000  [TO92-DGS]  174.62,90.81 0 top
Q231  2N7000  [TO92-DGS]  170.81,90.81 0 top
Q232  2N7000  [TO92-DGS]  170.81,85.72 0 top
Q233  2N7000  [TO92-DGS]  191.77,94.61 180 top
Q234  2N7000  [TO92-DGS]  166.37,94.61 180 top
Q235  2N7000  [TO92-DGS]  130.81,85.72 0 top
Q236  2N7000  [TO92-DGS]  130.81,90.81 0 top
Q237  2N7000  [TO92-DGS]  134.62,85.72 0 top
Q238  2N7000  [TO92-DGS]  134.62,90.81 0 top
Q239  2N7000  [TO92-DGS]  149.22,85.72 0 top
Q240  2N7000  [TO92-DGS]  149.22,90.81 0 top
Q241  2N7000  [TO92-DGS]  145.41,90.81 0 top
Q242  2N7000  [TO92-DGS]  145.41,85.72 0 top
Q243  2N7000  [TO92-DGS]  105.41,85.72 0 top
Q244  2N7000  [TO92-DGS]  105.41,90.81 0 top
Q245  2N7000  [TO92-DGS]  109.22,85.72 0 top
Q246  2N7000  [TO92-DGS]  109.22,90.81 0 top
Q247  2N7000  [TO92-DGS]  123.83,85.72 0 top
Q248  2N7000  [TO92-DGS]  123.83,90.81 0 top
Q249  2N7000  [TO92-DGS]  120.02,90.81 0 top
Q250  2N7000  [TO92-DGS]  120.02,85.72 0 top
Q251  2N7000  [TO92-DGS]  140.97,94.61 180 top
Q252  2N7000  [TO92-DGS]  115.57,94.61 180 top
Q253  2N7000  [TO92-DGS]  80.01,85.72 0 top
Q254  2N7000  [TO92-DGS]  80.01,90.81 0 top
Q255  2N7000  [TO92-DGS]  83.82,85.72 0 top
Q256  2N7000  [TO92-DGS]  83.82,90.81 0 top
Q257  2N7000  [TO92-DGS]  98.42,85.72 0 top
Q258  2N7000  [TO92-DGS]  98.42,90.81 0 top
Q259  2N7000  [TO92-DGS]  94.61,90.81 0 top
Q260  2N7000  [TO92-DGS]  94.61,85.72 0 top
Q261  2N7000  [TO92-DGS]  54.61,85.72 0 top
Q262  2N7000  [TO92-DGS]  54.61,90.81 0 top
Q263  2N7000  [TO92-DGS]  58.42,85.72 0 top
Q264  2N7000  [TO92-DGS]  58.42,90.81 0 top
Q265  2N7000  [TO92-DGS]  73.03,85.72 0 top
Q266  2N7000  [TO92-DGS]  73.03,90.81 0 top
Q267  2N7000  [TO92-DGS]  69.22,90.81 0 top
Q268  2N7000  [TO92-DGS]  69.22,85.72 0 top
Q269  2N7000  [TO92-DGS]  90.17,94.61 180 top
Q270  2N7000  [TO92-DGS]  64.77,94.61 180 top
Q271  2N7000  [TO92-DGS]  29.21,85.72 0 top
Q272  2N7000  [TO92-DGS]  29.21,90.81 0 top
Q273  2N7000  [TO92-DGS]  33.02,85.72 0 top
Q274  2N7000  [TO92-DGS]  33.02,90.81 0 top
Q275  2N7000  [TO92-DGS]  47.62,85.72 0 top
Q276  2N7000  [TO92-DGS]  47.62,90.81 0 top
Q277  2N7000  [TO92-DGS]  43.81,90.81 0 top
Q278  2N7000  [TO92-DGS]  43.81,85.72 0 top
Q279  2N7000  [TO92-DGS]  3.81,85.72 0 top
Q280  2N7000  [TO92-DGS]  3.81,90.81 0 top
Q281  2N7000  [TO92-DGS]  7.62,85.72 0 top
Q282  2N7000  [TO92-DGS]  7.62,90.81 0 top
Q283  2N7000  [TO92-DGS]  22.23,85.72 0 top
Q284  2N7000  [TO92-DGS]  22.23,90.81 0 top
Q285  2N7000  [TO92-DGS]  18.41,90.81 0 top
Q286  2N7000  [TO92-DGS]  18.41,85.72 0 top
Q287  2N7000  [TO92-DGS]  39.37,94.61 180 top
Q288  2N7000  [TO92-DGS]  13.97,94.61 180 top
Q289  2N7000  [TO92-DGS]  181.61,111.12 0 top
Q290  2N7000  [TO92-DGS]  181.61,116.2 0 top
Q291  2N7000  [TO92-DGS]  185.42,111.12 0 top
Q292  2N7000  [TO92-DGS]  185.42,116.2 0 top
Q293  2N7000  [TO92-DGS]  200.03,111.12 0 top
Q294  2N7000  [TO92-DGS]  200.03,116.2 0 top
Q295  2N7000  [TO92-DGS]  196.22,116.2 0 top
Q296  2N7000  [TO92-DGS]  196.22,111.12 0 top
Q297  2N7000  [TO92-DGS]  156.21,111.12 0 top
Q298  2N7000  [TO92-DGS]  156.21,116.2 0 top
Q299  2N7000  [TO92-DGS]  160.02,111.12 0 top
Q300  2N7000  [TO92-DGS]  160.02,116.2 0 top
Q301  2N7000  [TO92-DGS]  174.62,111.12 0 top
Q302  2N7000  [TO92-DGS]  174.62,116.2 0 top
Q303  2N7000  [TO92-DGS]  170.81,116.2 0 top
Q304  2N7000  [TO92-DGS]  170.81,111.12 0 top
Q305  2N7000  [TO92-DGS]  191.77,120.02 180 top
Q306  2N7000  [TO92-DGS]  166.37,120.02 180 top
Q307  2N7000  [TO92-DGS]  130.81,111.12 0 top
Q308  2N7000  [TO92-DGS]  130.81,116.2 0 top
Q309  2N7000  [TO92-DGS]  134.62,111.12 0 top
Q310  2N7000  [TO92-DGS]  134.62,116.2 0 top
Q311  2N7000  [TO92-DGS]  149.22,111.12 0 top
Q312  2N7000  [TO92-DGS]  149.22,116.2 0 top
Q313  2N7000  [TO92-DGS]  145.41,116.2 0 top
Q314  2N7000  [TO92-DGS]  145.41,111.12 0 top
Q315  2N7000  [TO92-DGS]  105.41,111.12 0 top
Q316  2N7000  [TO92-DGS]  105.41,116.2 0 top
Q317  2N7000  [TO92-DGS]  109.22,111.12 0 top
Q318  2N7000  [TO92-DGS]  109.22,116.2 0 top
Q319  2N7000  [TO92-DGS]  123.83,111.12 0 top
Q320  2N7000  [TO92-DGS]  123.83,116.2 0 top
Q321  2N7000  [TO92-DGS]  120.02,116.2 0 top
Q322  2N7000  [TO92-DGS]  120.02,111.12 0 top
Q323  2N7000  [TO92-DGS]  140.97,120.02 180 top
Q324  2N7000  [TO92-DGS]  115.57,120.02 180 top
Q325  2N7000  [TO92-DGS]  80.01,111.12 0 top
Q326  2N7000  [TO92-DGS]  80.01,116.2 0 top
Q327  2N7000  [TO92-DGS]  83.82,111.12 0 top
Q328  2N7000  [TO92-DGS]  83.82,116.2 0 top
Q329  2N7000  [TO92-DGS]  98.42,111.12 0 top
Q330  2N7000  [TO92-DGS]  98.42,116.2 0 top
Q331  2N7000  [TO92-DGS]  94.61,116.2 0 top
Q332  2N7000  [TO92-DGS]  94.61,111.12 0 top
Q333  2N7000  [TO92-DGS]  54.61,111.12 0 top
Q334  2N7000  [TO92-DGS]  54.61,116.2 0 top
Q335  2N7000  [TO92-DGS]  58.42,111.12 0 top
Q336  2N7000  [TO92-DGS]  58.42,116.2 0 top
Q337  2N7000  [TO92-DGS]  73.03,111.12 0 top
Q338  2N7000  [TO92-DGS]  73.03,116.2 0 top
Q339  2N7000  [TO92-DGS]  69.22,116.2 0 top
Q340  2N7000  [TO92-DGS]  69.22,111.12 0 top
Q341  2N7000  [TO92-DGS]  90.17,120.02 180 top
Q342  2N7000  [TO92-DGS]  64.77,120.02 180 top
Q343  2N7000  [TO92-DGS]  29.21,111.12 0 top
Q344  2N7000  [TO92-DGS]  29.21,116.2 0 top
Q345  2N7000  [TO92-DGS]  33.02,111.12 0 top
Q346  2N7000  [TO92-DGS]  33.02,116.2 0 top
Q347  2N7000  [TO92-DGS]  47.62,111.12 0 top
Q348  2N7000  [TO92-DGS]  47.62,116.2 0 top
Q349  2N7000  [TO92-DGS]  43.81,116.2 0 top
Q350  2N7000  [TO92-DGS]  43.81,111.12 0 top
Q351  2N7000  [TO92-DGS]  3.81,111.12 0 top
Q352  2N7000  [TO92-DGS]  3.81,116.2 0 top
Q353  2N7000  [TO92-DGS]  7.62,111.12 0 top
Q354  2N7000  [TO92-DGS]  7.62,116.2 0 top
Q355  2N7000  [TO92-DGS]  22.23,111.12 0 top
Q356  2N7000  [TO92-DGS]  22.23,116.2 0 top
Q357  2N7000  [TO92-DGS]  18.41,116.2 0 top
Q358  2N7000  [TO92-DGS]  18.41,111.12 0 top
Q359  2N7000  [TO92-DGS]  39.37,120.02 180 top
Q360  2N7000  [TO92-DGS]  13.97,120.02 180 top
Q361  2N7000  [TO92-DGS]  181.61,136.53 0 top
Q362  2N7000  [TO92-DGS]  181.61,141.6 0 top
Q363  2N7000  [TO92-DGS]  185.42,136.53 0 top
Q364  2N7000  [TO92-DGS]  185.42,141.6 0 top
Q365  2N7000  [TO92-DGS]  200.03,136.53 0 top
Q366  2N7000  [TO92-DGS]  200.03,141.6 0 top
Q367  2N7000  [TO92-DGS]  196.22,141.6 0 top
Q368  2N7000  [TO92-DGS]  196.22,136.53 0 top
Q369  2N7000  [TO92-DGS]  156.21,136.53 0 top
Q370  2N7000  [TO92-DGS]  156.21,141.6 0 top
Q371  2N7000  [TO92-DGS]  160.02,136.53 0 top
Q372  2N7000  [TO92-DGS]  160.02,141.6 0 top
Q373  2N7000  [TO92-DGS]  174.62,136.53 0 top
Q374  2N7000  [TO92-DGS]  174.62,141.6 0 top
Q375  2N7000  [TO92-DGS]  170.81,141.6 0 top
Q376  2N7000  [TO92-DGS]  170.81,136.53 0 top
Q377  2N7000  [TO92-DGS]  191.77,145.41 180 top
Q378  2N7000  [TO92-DGS]  166.37,145.41 180 top
Q379  2N7000  [TO92-DGS]  130.81,136.53 0 top
Q380  2N7000  [TO92-DGS]  130.81,141.6 0 top
Q381  2N7000  [TO92-DGS]  134.62,136.53 0 top
Q382  2N7000  [TO92-DGS]  134.62,141.6 0 top
Q383  2N7000  [TO92-DGS]  149.22,136.53 0 top
Q384  2N7000  [TO92-DGS]  149.22,141.6 0 top
Q385  2N7000  [TO92-DGS]  145.41,141.6 0 top
Q386  2N7000  [TO92-DGS]  145.41,136.53 0 top
Q387  2N7000  [TO92-DGS]  105.41,136.53 0 top
Q388  2N7000  [TO92-DGS]  105.41,141.6 0 top
Q389  2N7000  [TO92-DGS]  109.22,136.53 0 top
Q390  2N7000  [TO92-DGS]  109.22,141.6 0 top
Q391  2N7000  [TO92-DGS]  123.83,136.53 0 top
Q392  2N7000  [TO92-DGS]  123.83,141.6 0 top
Q393  2N7000  [TO92-DGS]  120.02,141.6 0 top
Q394  2N7000  [TO92-DGS]  120.02,136.53 0 top
Q395  2N7000  [TO92-DGS]  140.97,145.41 180 top
Q396  2N7000  [TO92-DGS]  115.57,145.41 180 top
Q397  2N7000  [TO92-DGS]  80.01,136.53 0 top
Q398  2N7000  [TO92-DGS]  80.01,141.6 0 top
Q399  2N7000  [TO92-DGS]  83.82,136.53 0 top
Q400  2N7000  [TO92-DGS]  83.82,141.6 0 top
Q401  2N7000  [TO92-DGS]  98.42,136.53 0 top
Q402  2N7000  [TO92-DGS]  98.42,141.6 0 top
Q403  2N7000  [TO92-DGS]  94.61,141.6 0 top
Q404  2N7000  [TO92-DGS]  94.61,136.53 0 top
Q405  2N7000  [TO92-DGS]  54.61,136.53 0 top
Q406  2N7000  [TO92-DGS]  54.61,141.6 0 top
Q407  2N7000  [TO92-DGS]  58.42,136.53 0 top
Q408  2N7000  [TO92-DGS]  58.42,141.6 0 top
Q409  2N7000  [TO92-DGS]  73.03,136.53 0 top
Q410  2N7000  [TO92-DGS]  73.03,141.6 0 top
Q411  2N7000  [TO92-DGS]  69.22,141.6 0 top
Q412  2N7000  [TO92-DGS]  69.22,136.53 0 top
Q413  2N7000  [TO92-DGS]  90.17,145.41 180 top
Q414  2N7000  [TO92-DGS]  64.77,145.41 180 top
Q415  2N7000  [TO92-DGS]  29.21,136.53 0 top
Q416  2N7000  [TO92-DGS]  29.21,141.6 0 top
Q417  2N7000  [TO92-DGS]  33.02,136.53 0 top
Q418  2N7000  [TO92-DGS]  33.02,141.6 0 top
Q419  2N7000  [TO92-DGS]  47.62,136.53 0 top
Q420  2N7000  [TO92-DGS]  47.62,141.6 0 top
Q421  2N7000  [TO92-DGS]  43.81,141.6 0 top
Q422  2N7000  [TO92-DGS]  43.81,136.53 0 top
Q423  2N7000  [TO92-DGS]  3.81,136.53 0 top
Q424  2N7000  [TO92-DGS]  3.81,141.6 0 top
Q425  2N7000  [TO92-DGS]  7.62,136.53 0 top
Q426  2N7000  [TO92-DGS]  7.62,141.6 0 top
Q427  2N7000  [TO92-DGS]  22.23,136.53 0 top
Q428  2N7000  [TO92-DGS]  22.23,141.6 0 top
Q429  2N7000  [TO92-DGS]  18.41,141.6 0 top
Q430  2N7000  [TO92-DGS]  18.41,136.53 0 top
Q431  2N7000  [TO92-DGS]  39.37,145.41 180 top
Q432  2N7000  [TO92-DGS]  13.97,145.41 180 top
Q433  2N7000  [TO92-DGS]  181.61,161.93 0 top
Q434  2N7000  [TO92-DGS]  181.61,167 0 top
Q435  2N7000  [TO92-DGS]  185.42,161.93 0 top
Q436  2N7000  [TO92-DGS]  185.42,167 0 top
Q437  2N7000  [TO92-DGS]  200.03,161.93 0 top
Q438  2N7000  [TO92-DGS]  200.03,167 0 top
Q439  2N7000  [TO92-DGS]  196.22,167 0 top
Q440  2N7000  [TO92-DGS]  196.22,161.93 0 top
Q441  2N7000  [TO92-DGS]  156.21,161.93 0 top
Q442  2N7000  [TO92-DGS]  156.21,167 0 top
Q443  2N7000  [TO92-DGS]  160.02,161.93 0 top
Q444  2N7000  [TO92-DGS]  160.02,167 0 top
Q445  2N7000  [TO92-DGS]  174.62,161.93 0 top
Q446  2N7000  [TO92-DGS]  174.62,167 0 top
Q447  2N7000  [TO92-DGS]  170.81,167 0 top
Q448  2N7000  [TO92-DGS]  170.81,161.93 0 top
Q449  2N7000  [TO92-DGS]  191.77,170.81 180 top
Q450  2N7000  [TO92-DGS]  166.37,170.81 180 top
Q451  2N7000  [TO92-DGS]  130.81,161.93 0 top
Q452  2N7000  [TO92-DGS]  130.81,167 0 top
Q453  2N7000  [TO92-DGS]  134.62,161.93 0 top
Q454  2N7000  [TO92-DGS]  134.62,167 0 top
Q455  2N7000  [TO92-DGS]  149.22,161.93 0 top
Q456  2N7000  [TO92-DGS]  149.22,167 0 top
Q457  2N7000  [TO92-DGS]  145.41,167 0 top
Q458  2N7000  [TO92-DGS]  145.41,161.93 0 top
Q459  2N7000  [TO92-DGS]  105.41,161.93 0 top
Q460  2N7000  [TO92-DGS]  105.41,167 0 top
Q461  2N7000  [TO92-DGS]  109.22,161.93 0 top
Q462  2N7000  [TO92-DGS]  109.22,167 0 top
Q463  2N7000  [TO92-DGS]  123.83,161.93 0 top
Q464  2N7000  [TO92-DGS]  123.83,167 0 top
Q465  2N7000  [TO92-DGS]  120.02,167 0 top
Q466  2N7000  [TO92-DGS]  120.02,161.93 0 top
Q467  2N7000  [TO92-DGS]  140.97,170.81 180 top
Q468  2N7000  [TO92-DGS]  115.57,170.81 180 top
Q469  2N7000  [TO92-DGS]  80.01,161.93 0 top
Q470  2N7000  [TO92-DGS]  80.01,167 0 top
Q471  2N7000  [TO92-DGS]  83.82,161.93 0 top
Q472  2N7000  [TO92-DGS]  83.82,167 0 top
Q473  2N7000  [TO92-DGS]  98.42,161.93 0 top
Q474  2N7000  [TO92-DGS]  98.42,167 0 top
Q475  2N7000  [TO92-DGS]  94.61,167 0 top
Q476  2N7000  [TO92-DGS]  94.61,161.93 0 top
Q477  2N7000  [TO92-DGS]  54.61,161.93 0 top
Q478  2N7000  [TO92-DGS]  54.61,167 0 top
Q479  2N7000  [TO92-DGS]  58.42,161.93 0 top
Q480  2N7000  [TO92-DGS]  58.42,167 0 top
Q481  2N7000  [TO92-DGS]  73.03,161.93 0 top
Q482  2N7000  [TO92-DGS]  73.03,167 0 top
Q483  2N7000  [TO92-DGS]  69.22,167 0 top
Q484  2N7000  [TO92-DGS]  69.22,161.93 0 top
Q485  2N7000  [TO92-DGS]  90.17,170.81 180 top
Q486  2N7000  [TO92-DGS]  64.77,170.81 180 top
Q487  2N7000  [TO92-DGS]  29.21,161.93 0 top
Q488  2N7000  [TO92-DGS]  29.21,167 0 top
Q489  2N7000  [TO92-DGS]  33.02,161.93 0 top
Q490  2N7000  [TO92-DGS]  33.02,167 0 top
Q491  2N7000  [TO92-DGS]  47.62,161.93 0 top
Q492  2N7000  [TO92-DGS]  47.62,167 0 top
Q493  2N7000  [TO92-DGS]  43.81,167 0 top
Q494  2N7000  [TO92-DGS]  43.81,161.93 0 top
Q495  2N7000  [TO92-DGS]  3.81,161.93 0 top
Q496  2N7000  [TO92-DGS]  3.81,167 0 top
Q497  2N7000  [TO92-DGS]  7.62,161.93 0 top
Q498  2N7000  [TO92-DGS]  7.62,167 0 top
Q499  2N7000  [TO92-DGS]  22.23,161.93 0 top
Q500  2N7000  [TO92-DGS]  22.23,167 0 top
Q501  2N7000  [TO92-DGS]  18.41,167 0 top
Q502  2N7000  [TO92-DGS]  18.41,161.93 0 top
Q503  2N7000  [TO92-DGS]  39.37,170.81 180 top
Q504  2N7000  [TO92-DGS]  13.97,170.81 180 top
Q505  2N7000  [TO92-DGS]  181.61,187.32 0 top
Q506  2N7000  [TO92-DGS]  181.61,192.41 0 top
Q507  2N7000  [TO92-DGS]  185.42,187.32 0 top
Q508  2N7000  [TO92-DGS]  185.42,192.41 0 top
Q509  2N7000  [TO92-DGS]  200.03,187.32 0 top
Q510  2N7000  [TO92-DGS]  200.03,192.41 0 top
Q511  2N7000  [TO92-DGS]  196.22,192.41 0 top
Q512  2N7000  [TO92-DGS]  196.22,187.32 0 top
Q513  2N7000  [TO92-DGS]  156.21,187.32 0 top
Q514  2N7000  [TO92-DGS]  156.21,192.41 0 top
Q515  2N7000  [TO92-DGS]  160.02,187.32 0 top
Q516  2N7000  [TO92-DGS]  160.02,192.41 0 top
Q517  2N7000  [TO92-DGS]  174.62,187.32 0 top
Q518  2N7000  [TO92-DGS]  174.62,192.41 0 top
Q519  2N7000  [TO92-DGS]  170.81,192.41 0 top
Q520  2N7000  [TO92-DGS]  170.81,187.32 0 top
Q521  2N7000  [TO92-DGS]  191.77,196.22 180 top
Q522  2N7000  [TO92-DGS]  166.37,196.22 180 top
Q523  2N7000  [TO92-DGS]  130.81,187.32 0 top
Q524  2N7000  [TO92-DGS]  130.81,192.41 0 top
Q525  2N7000  [TO92-DGS]  134.62,187.32 0 top
Q526  2N7000  [TO92-DGS]  134.62,192.41 0 top
Q527  2N7000  [TO92-DGS]  149.22,187.32 0 top
Q528  2N7000  [TO92-DGS]  149.22,192.41 0 top
Q529  2N7000  [TO92-DGS]  145.41,192.41 0 top
Q530  2N7000  [TO92-DGS]  145.41,187.32 0 top
Q531  2N7000  [TO92-DGS]  105.41,187.32 0 top
Q532  2N7000  [TO92-DGS]  105.41,192.41 0 top
Q533  2N7000  [TO92-DGS]  109.22,187.32 0 top
Q534  2N7000  [TO92-DGS]  109.22,192.41 0 top
Q535  2N7000  [TO92-DGS]  123.83,187.32 0 top
Q536  2N7000  [TO92-DGS]  123.83,192.41 0 top
Q537  2N7000  [TO92-DGS]  120.02,192.41 0 top
Q538  2N7000  [TO92-DGS]  120.02,187.32 0 top
Q539  2N7000  [TO92-DGS]  140.97,196.22 180 top
Q540  2N7000  [TO92-DGS]  115.57,196.22 180 top
Q541  2N7000  [TO92-DGS]  80.01,187.32 0 top
Q542  2N7000  [TO92-DGS]  80.01,192.41 0 top
Q543  2N7000  [TO92-DGS]  83.82,187.32 0 top
Q544  2N7000  [TO92-DGS]  83.82,192.41 0 top
Q545  2N7000  [TO92-DGS]  98.42,187.32 0 top
Q546  2N7000  [TO92-DGS]  98.42,192.41 0 top
Q547  2N7000  [TO92-DGS]  94.61,192.41 0 top
Q548  2N7000  [TO92-DGS]  94.61,187.32 0 top
Q549  2N7000  [TO92-DGS]  54.61,187.32 0 top
Q550  2N7000  [TO92-DGS]  54.61,192.41 0 top
Q551  2N7000  [TO92-DGS]  58.42,187.32 0 top
Q552  2N7000  [TO92-DGS]  58.42,192.41 0 top
Q553  2N7000  [TO92-DGS]  73.03,187.32 0 top
Q554  2N7000  [TO92-DGS]  73.03,192.41 0 top
Q555  2N7000  [TO92-DGS]  69.22,192.41 0 top
Q556  2N7000  [TO92-DGS]  69.22,187.32 0 top
Q557  2N7000  [TO92-DGS]  90.17,196.22 180 top
Q558  2N7000  [TO92-DGS]  64.77,196.22 180 top
Q559  2N7000  [TO92-DGS]  29.21,187.32 0 top
Q560  2N7000  [TO92-DGS]  29.21,192.41 0 top
Q561  2N7000  [TO92-DGS]  33.02,187.32 0 top
Q562  2N7000  [TO92-DGS]  33.02,192.41 0 top
Q563  2N7000  [TO92-DGS]  47.62,187.32 0 top
Q564  2N7000  [TO92-DGS]  47.62,192.41 0 top
Q565  2N7000  [TO92-DGS]  43.81,192.41 0 top
Q566  2N7000  [TO92-DGS]  43.81,187.32 0 top
Q567  2N7000  [TO92-DGS]  3.81,187.32 0 top
Q568  2N7000  [TO92-DGS]  3.81,192.41 0 top
Q569  2N7000  [TO92-DGS]  7.62,187.32 0 top
Q570  2N7000  [TO92-DGS]  7.62,192.41 0 top
Q571  2N7000  [TO92-DGS]  22.23,187.32 0 top
Q572  2N7000  [TO92-DGS]  22.23,192.41 0 top
Q573  2N7000  [TO92-DGS]  18.41,192.41 0 top
Q574  2N7000  [TO92-DGS]  18.41,187.32 0 top
Q575  2N7000  [TO92-DGS]  39.37,196.22 180 top
Q576  2N7000  [TO92-DGS]  13.97,196.22 180 top
Q594  2N7000  [TO92-DGS]  118.75,102.87 0 bottom
Q595  2N7000  [TO92-DGS]  125.73,102.23 180 bottom
Q596  2N7000  [TO92-DGS]  134.62,104.14 180 bottom
Q597  2N7000  [TO92-DGS]  190.5,14.61 90 top
Q599  2N7000  [TO92-DGS]  148.59,26.04 0 bottom
Q600  2N7000  [TO92-DGS]  158.75,26.04 180 bottom
Q601  2N7000  [TO92-DGS]  165.1,26.04 0 bottom
Q603  2N7000  [TO92-DGS]  144.78,26.04 180 bottom
Q604  2N7000  [TO92-DGS]  130.81,26.04 180 bottom
Q608  2N7000  [TO92-DGS]  168.91,26.04 0 bottom
Q609  2N7000  [TO92-DGS]  173.99,26.04 180 bottom
Q610  2N7000  [TO92-DGS]  176.53,26.04 0 bottom
Q612  2N7000  [TO92-DGS]  138.43,26.04 0 bottom
Q613  2N7000  [TO92-DGS]  133.35,26.04 0 bottom
Q614  2N7000  [TO92-DGS]  190.5,40.01 90 top
Q618  2N7000  [TO92-DGS]  163.19,52.07 0 bottom
Q619  2N7000  [TO92-DGS]  173.99,52.07 180 bottom
Q620  2N7000  [TO92-DGS]  176.53,52.07 0 bottom
Q622  2N7000  [TO92-DGS]  158.75,52.07 0 bottom
Q623  2N7000  [TO92-DGS]  156.21,52.07 180 bottom
Q624  2N7000  [TO92-DGS]  190.5,65.41 90 top
Q625  2N7000  [TO92-DGS]  163.19,77.47 0 bottom
Q626  2N7000  [TO92-DGS]  168.91,76.2 180 bottom
Q627  2N7000  [TO92-DGS]  176.53,76.2 0 bottom
Q629  2N7000  [TO92-DGS]  158.75,77.47 0 bottom
Q630  2N7000  [TO92-DGS]  154.94,77.47 0 bottom
Q631  2N7000  [TO92-DGS]  190.5,90.81 90 top
Q632  2N7000  [TO92-DGS]  164.47,103.5 270 bottom
Q633  2N7000  [TO92-DGS]  174.62,102.87 0 bottom
Q634  2N7000  [TO92-DGS]  170.18,102.87 180 bottom
Q636  2N7000  [TO92-DGS]  158.75,102.87 0 bottom
Q637  2N7000  [TO92-DGS]  149.86,102.87 0 bottom
Q638  2N7000  [TO92-DGS]  190.5,116.2 90 top
Q639  2N7000  [TO92-DGS]  163.19,128.27 0 bottom
Q640  2N7000  [TO92-DGS]  171.45,128.27 180 bottom
Q641  2N7000  [TO92-DGS]  175.9,128.27 0 bottom
Q643  2N7000  [TO92-DGS]  158.75,128.27 0 bottom
Q644  2N7000  [TO92-DGS]  154.94,128.27 0 bottom
Q645  2N7000  [TO92-DGS]  190.5,141.6 90 top
Q646  2N7000  [TO92-DGS]  157.48,153.03 0 bottom
Q647  2N7000  [TO92-DGS]  170.18,153.03 180 bottom
Q648  2N7000  [TO92-DGS]  175.9,153.67 0 bottom
Q650  2N7000  [TO92-DGS]  150.5,153.03 0 bottom
Q651  2N7000  [TO92-DGS]  146.05,153.03 0 bottom
Q652  2N7000  [TO92-DGS]  190.5,167 90 top
Q653  2N7000  [TO92-DGS]  163.19,178.44 0 bottom
Q654  2N7000  [TO92-DGS]  171.45,178.44 180 bottom
Q655  2N7000  [TO92-DGS]  175.9,178.44 0 bottom
Q657  2N7000  [TO92-DGS]  158.75,178.44 0 bottom
Q658  2N7000  [TO92-DGS]  144.15,179.71 0 bottom
Q659  2N7000  [TO92-DGS]  190.5,192.41 90 top
Q686  2N7000  [TO92-DGS]  189.23,18.41 0 top
Q687  2N7000  [TO92-DGS]  163.83,18.41 0 top
Q688  2N7000  [TO92-DGS]  138.43,18.41 0 top
Q689  2N7000  [TO92-DGS]  113.03,18.41 0 top
Q690  2N7000  [TO92-DGS]  62.23,18.41 0 top
Q691  2N7000  [TO92-DGS]  87.63,18.41 0 top
Q692  2N7000  [TO92-DGS]  36.83,18.41 0 top
Q693  2N7000  [TO92-DGS]  11.43,18.41 0 top
Q694  2N7000  [TO92-DGS]  189.23,43.81 0 top
Q695  2N7000  [TO92-DGS]  163.83,43.81 0 top
Q696  2N7000  [TO92-DGS]  113.03,43.81 0 top
Q697  2N7000  [TO92-DGS]  138.43,43.81 0 top
Q698  2N7000  [TO92-DGS]  87.63,43.81 0 top
Q699  2N7000  [TO92-DGS]  62.23,43.81 0 top
Q700  2N7000  [TO92-DGS]  36.83,43.81 0 top
Q701  2N7000  [TO92-DGS]  11.43,43.81 0 top
Q702  2N7000  [TO92-DGS]  189.23,69.22 0 top
Q703  2N7000  [TO92-DGS]  163.83,69.22 0 top
Q704  2N7000  [TO92-DGS]  138.43,69.22 0 top
Q705  2N7000  [TO92-DGS]  113.03,69.22 0 top
Q706  2N7000  [TO92-DGS]  87.63,69.22 0 top
Q707  2N7000  [TO92-DGS]  62.23,69.22 0 top
Q708  2N7000  [TO92-DGS]  36.83,69.22 0 top
Q709  2N7000  [TO92-DGS]  11.43,69.22 0 top
Q710  2N7000  [TO92-DGS]  189.23,94.61 0 top
Q711  2N7000  [TO92-DGS]  163.83,94.61 0 top
Q712  2N7000  [TO92-DGS]  138.43,94.61 0 top
Q713  2N7000  [TO92-DGS]  113.03,94.61 0 top
Q714  2N7000  [TO92-DGS]  87.63,94.61 0 top
Q715  2N7000  [TO92-DGS]  62.23,94.61 0 top
Q716  2N7000  [TO92-DGS]  36.83,94.61 0 top
Q717  2N7000  [TO92-DGS]  11.43,94.61 0 top
Q718  2N7000  [TO92-DGS]  189.23,120.02 0 top
Q719  2N7000  [TO92-DGS]  163.83,120.02 0 top
Q720  2N7000  [TO92-DGS]  138.43,120.02 0 top
Q721  2N7000  [TO92-DGS]  113.03,120.02 0 top
Q722  2N7000  [TO92-DGS]  87.63,120.02 0 top
Q723  2N7000  [TO92-DGS]  62.23,120.02 0 top
Q724  2N7000  [TO92-DGS]  36.83,120.02 0 top
Q725  2N7000  [TO92-DGS]  11.43,120.02 0 top
Q726  2N7000  [TO92-DGS]  189.23,145.41 0 top
Q727  2N7000  [TO92-DGS]  163.83,145.41 0 top
Q728  2N7000  [TO92-DGS]  138.43,145.41 0 top
Q729  2N7000  [TO92-DGS]  113.03,145.41 0 top
Q730  2N7000  [TO92-DGS]  87.63,145.41 0 top
Q731  2N7000  [TO92-DGS]  62.23,145.41 0 top
Q732  2N7000  [TO92-DGS]  36.83,145.41 0 top
Q733  2N7000  [TO92-DGS]  11.43,145.41 0 top
Q734  2N7000  [TO92-DGS]  189.23,170.81 0 top
Q735  2N7000  [TO92-DGS]  163.83,170.81 0 top
Q736  2N7000  [TO92-DGS]  138.43,170.81 0 top
Q737  2N7000  [TO92-DGS]  113.03,170.81 0 top
Q738  2N7000  [TO92-DGS]  87.63,170.81 0 top
Q739  2N7000  [TO92-DGS]  62.23,170.81 0 top
Q740  2N7000  [TO92-DGS]  36.83,170.81 0 top
Q741  2N7000  [TO92-DGS]  11.43,170.81 0 top
Q742  2N7000  [TO92-DGS]  163.83,196.22 0 top
Q743  2N7000  [TO92-DGS]  189.23,196.22 0 top
Q744  2N7000  [TO92-DGS]  138.43,196.22 0 top
Q745  2N7000  [TO92-DGS]  113.03,196.22 0 top
Q746  2N7000  [TO92-DGS]  62.23,196.22 0 top
Q747  2N7000  [TO92-DGS]  87.63,196.22 0 top
Q748  2N7000  [TO92-DGS]  36.83,196.22 0 top
Q749  2N7000  [TO92-DGS]  11.43,196.22 0 top
Q750  2N7000  [TO92-DGS]  78.74,127.64 0 bottom
Q753  2N7000  [TO92-DGS]  82.55,127.64 0 bottom
Q754  2N7000  [TO92-DGS]  90.81,128.27 0 bottom
Q755  2N7000  [TO92-DGS]  74.93,127.64 180 bottom
Q756  2N7000  [TO92-DGS]  115.57,50.8 180 bottom
Q758  2N7000  [TO92-DGS]  120.02,50.8 180 bottom
Q759  2N7000  [TO92-DGS]  165.1,14.61 90 top
Q760  2N7000  [TO92-DGS]  165.1,40.01 90 top
Q761  2N7000  [TO92-DGS]  165.1,65.41 90 top
Q762  2N7000  [TO92-DGS]  165.1,90.81 90 top
Q763  2N7000  [TO92-DGS]  165.1,116.2 90 top
Q764  2N7000  [TO92-DGS]  165.1,141.6 90 top
Q765  2N7000  [TO92-DGS]  165.1,167 90 top
Q766  2N7000  [TO92-DGS]  165.1,192.41 90 top
Q767  2N7000  [TO92-DGS]  145.41,77.47 0 bottom
Q769  2N7000  [TO92-DGS]  141.6,77.47 180 bottom
Q770  2N7000  [TO92-DGS]  139.7,14.61 90 top
Q771  2N7000  [TO92-DGS]  139.7,40.01 90 top
Q772  2N7000  [TO92-DGS]  139.7,65.41 90 top
Q773  2N7000  [TO92-DGS]  139.7,90.81 90 top
Q774  2N7000  [TO92-DGS]  139.7,116.2 90 top
Q775  2N7000  [TO92-DGS]  139.7,141.6 90 top
Q776  2N7000  [TO92-DGS]  139.7,167 90 top
Q777  2N7000  [TO92-DGS]  139.7,192.41 90 top
Q778  2N7000  [TO92-DGS]  67.94,26.67 0 bottom
Q780  2N7000  [TO92-DGS]  63.5,26.67 0 bottom
Q781  2N7000  [TO92-DGS]  114.3,14.61 90 top
Q782  2N7000  [TO92-DGS]  114.3,40.01 90 top
Q783  2N7000  [TO92-DGS]  114.3,65.41 90 top
Q784  2N7000  [TO92-DGS]  114.3,90.81 90 top
Q785  2N7000  [TO92-DGS]  114.3,116.2 90 top
Q786  2N7000  [TO92-DGS]  114.3,141.6 90 top
Q787  2N7000  [TO92-DGS]  114.3,167 90 top
Q788  2N7000  [TO92-DGS]  114.3,192.41 90 top
Q789  2N7000  [TO92-DGS]  98.42,78.11 0 bottom
Q791  2N7000  [TO92-DGS]  95.25,78.11 180 bottom
Q792  2N7000  [TO92-DGS]  88.9,14.61 90 top
Q793  2N7000  [TO92-DGS]  88.9,40.01 90 top
Q794  2N7000  [TO92-DGS]  88.9,65.41 90 top
Q795  2N7000  [TO92-DGS]  88.9,90.81 90 top
Q796  2N7000  [TO92-DGS]  88.9,116.2 90 top
Q797  2N7000  [TO92-DGS]  88.9,141.6 90 top
Q798  2N7000  [TO92-DGS]  88.9,167 90 top
Q799  2N7000  [TO92-DGS]  88.9,192.41 90 top
Q800  2N7000  [TO92-DGS]  82.55,76.83 0 bottom
Q802  2N7000  [TO92-DGS]  80.01,76.83 180 bottom
Q803  2N7000  [TO92-DGS]  63.5,14.61 90 top
Q804  2N7000  [TO92-DGS]  63.5,40.01 90 top
Q805  2N7000  [TO92-DGS]  63.5,65.41 90 top
Q806  2N7000  [TO92-DGS]  63.5,90.81 90 top
Q807  2N7000  [TO92-DGS]  63.5,116.2 90 top
Q808  2N7000  [TO92-DGS]  63.5,141.6 90 top
Q809  2N7000  [TO92-DGS]  63.5,167 90 top
Q810  2N7000  [TO92-DGS]  63.5,192.41 90 top
Q811  2N7000  [TO92-DGS]  62.87,77.47 180 bottom
Q813  2N7000  [TO92-DGS]  65.41,77.47 0 bottom
Q814  2N7000  [TO92-DGS]  38.1,14.61 90 top
Q815  2N7000  [TO92-DGS]  38.1,40.01 90 top
Q816  2N7000  [TO92-DGS]  38.1,65.41 90 top
Q817  2N7000  [TO92-DGS]  38.1,90.81 90 top
Q818  2N7000  [TO92-DGS]  38.1,116.2 90 top
Q819  2N7000  [TO92-DGS]  38.1,141.6 90 top
Q820  2N7000  [TO92-DGS]  38.1,167 90 top
Q821  2N7000  [TO92-DGS]  38.1,192.41 90 top
Q822  2N7000  [TO92-DGS]  40.64,27.94 180 bottom
Q824  2N7000  [TO92-DGS]  45.72,27.94 0 bottom
Q825  2N7000  [TO92-DGS]  12.7,14.61 90 top
Q826  2N7000  [TO92-DGS]  12.7,40.01 90 top
Q827  2N7000  [TO92-DGS]  12.7,65.41 90 top
Q828  2N7000  [TO92-DGS]  12.7,90.81 90 top
Q829  2N7000  [TO92-DGS]  12.7,116.2 90 top
Q830  2N7000  [TO92-DGS]  12.7,141.6 90 top
Q831  2N7000  [TO92-DGS]  12.7,167 90 top
Q832  2N7000  [TO92-DGS]  12.7,192.41 90 top
Q833  2N7000  [TO92-DGS]  12.7,76.83 180 bottom
Q835  2N7000  [TO92-DGS]  15.24,76.83 0 bottom
R1  10k  [R_P2INCH]  182.88,18.41 0 top
R2  10k  [R_P2INCH]  182.88,20.32 180 top
R3  10k  [R_P2INCH]  198.12,18.41 0 top
R4  10k  [R_P2INCH]  198.12,20.32 0 top
R5  470  [R_P2INCH]  190.5,8.89 180 top
R6  10k  [R_P2INCH]  157.48,18.41 0 top
R7  10k  [R_P2INCH]  157.48,20.32 180 top
R8  10k  [R_P2INCH]  172.72,18.41 0 top
R9  10k  [R_P2INCH]  172.72,20.32 0 top
R10  470  [R_P2INCH]  165.1,8.89 180 top
R11  10k  [R_P2INCH]  182.88,43.81 0 top
R12  10k  [R_P2INCH]  182.88,45.72 180 top
R13  10k  [R_P2INCH]  198.12,43.81 0 top
R14  10k  [R_P2INCH]  198.12,45.72 0 top
R15  470  [R_P2INCH]  190.5,34.29 180 top
R16  10k  [R_P2INCH]  157.48,43.81 0 top
R17  10k  [R_P2INCH]  157.48,45.72 180 top
R18  10k  [R_P2INCH]  172.72,43.81 0 top
R19  10k  [R_P2INCH]  172.72,45.72 0 top
R20  470  [R_P2INCH]  165.1,34.29 180 top
R21  10k  [R_P2INCH]  132.08,18.41 0 top
R22  10k  [R_P2INCH]  132.08,20.32 180 top
R23  10k  [R_P2INCH]  147.32,18.41 0 top
R24  10k  [R_P2INCH]  147.32,20.32 0 top
R25  470  [R_P2INCH]  139.7,8.89 180 top
R26  10k  [R_P2INCH]  106.68,18.41 0 top
R27  10k  [R_P2INCH]  106.68,20.32 180 top
R28  10k  [R_P2INCH]  121.92,18.41 0 top
R29  10k  [R_P2INCH]  121.92,20.32 0 top
R30  470  [R_P2INCH]  114.3,8.89 180 top
R31  10k  [R_P2INCH]  81.28,18.41 0 top
R32  10k  [R_P2INCH]  81.28,20.32 180 top
R33  10k  [R_P2INCH]  96.52,18.41 0 top
R34  10k  [R_P2INCH]  96.52,20.32 0 top
R35  470  [R_P2INCH]  88.9,8.89 180 top
R36  10k  [R_P2INCH]  55.88,18.41 0 top
R37  10k  [R_P2INCH]  55.88,20.32 180 top
R38  10k  [R_P2INCH]  71.12,18.41 0 top
R39  10k  [R_P2INCH]  71.12,20.32 0 top
R40  470  [R_P2INCH]  63.5,8.89 180 top
R41  10k  [R_P2INCH]  30.48,18.41 0 top
R42  10k  [R_P2INCH]  30.48,20.32 180 top
R43  10k  [R_P2INCH]  45.72,18.41 0 top
R44  10k  [R_P2INCH]  45.72,20.32 0 top
R45  470  [R_P2INCH]  38.1,8.89 180 top
R46  10k  [R_P2INCH]  5.08,18.41 0 top
R47  10k  [R_P2INCH]  5.08,20.32 180 top
R48  10k  [R_P2INCH]  20.32,18.41 0 top
R49  10k  [R_P2INCH]  20.32,20.32 0 top
R50  470  [R_P2INCH]  12.7,8.89 180 top
R51  10k  [R_P2INCH]  132.08,43.81 0 top
R52  10k  [R_P2INCH]  132.08,45.72 180 top
R53  10k  [R_P2INCH]  147.32,43.81 0 top
R54  10k  [R_P2INCH]  147.32,45.72 0 top
R55  470  [R_P2INCH]  139.7,34.29 180 top
R56  10k  [R_P2INCH]  106.68,43.81 0 top
R57  10k  [R_P2INCH]  106.68,45.72 180 top
R58  10k  [R_P2INCH]  121.92,43.81 0 top
R59  10k  [R_P2INCH]  121.92,45.72 0 top
R60  470  [R_P2INCH]  114.3,34.29 180 top
R61  10k  [R_P2INCH]  81.28,43.81 0 top
R62  10k  [R_P2INCH]  81.28,45.72 180 top
R63  10k  [R_P2INCH]  96.52,43.81 0 top
R64  10k  [R_P2INCH]  96.52,45.72 0 top
R65  470  [R_P2INCH]  88.9,34.29 180 top
R66  10k  [R_P2INCH]  55.88,43.81 0 top
R67  10k  [R_P2INCH]  55.88,45.72 180 top
R68  10k  [R_P2INCH]  71.12,43.81 0 top
R69  10k  [R_P2INCH]  71.12,45.72 0 top
R70  470  [R_P2INCH]  63.5,34.29 180 top
R71  10k  [R_P2INCH]  30.48,43.81 0 top
R72  10k  [R_P2INCH]  30.48,45.72 180 top
R73  10k  [R_P2INCH]  45.72,43.81 0 top
R74  10k  [R_P2INCH]  45.72,45.72 0 top
R75  470  [R_P2INCH]  38.1,34.29 180 top
R76  10k  [R_P2INCH]  5.08,43.81 0 top
R77  10k  [R_P2INCH]  5.08,45.72 180 top
R78  10k  [R_P2INCH]  20.32,43.81 0 top
R79  10k  [R_P2INCH]  20.32,45.72 0 top
R80  470  [R_P2INCH]  12.7,34.29 180 top
R81  10k  [R_P2INCH]  182.88,69.22 0 top
R82  10k  [R_P2INCH]  182.88,71.12 180 top
R83  10k  [R_P2INCH]  198.12,69.22 0 top
R84  10k  [R_P2INCH]  198.12,71.12 0 top
R85  470  [R_P2INCH]  190.5,59.69 180 top
R86  10k  [R_P2INCH]  157.48,69.22 0 top
R87  10k  [R_P2INCH]  157.48,71.12 180 top
R88  10k  [R_P2INCH]  172.72,69.22 0 top
R89  10k  [R_P2INCH]  172.72,71.12 0 top
R90  470  [R_P2INCH]  165.1,59.69 180 top
R91  10k  [R_P2INCH]  132.08,69.22 0 top
R92  10k  [R_P2INCH]  132.08,71.12 180 top
R93  10k  [R_P2INCH]  147.32,69.22 0 top
R94  10k  [R_P2INCH]  147.32,71.12 0 top
R95  470  [R_P2INCH]  139.7,59.69 180 top
R96  10k  [R_P2INCH]  106.68,69.22 0 top
R97  10k  [R_P2INCH]  106.68,71.12 180 top
R98  10k  [R_P2INCH]  121.92,69.22 0 top
R99  10k  [R_P2INCH]  121.92,71.12 0 top
R100  470  [R_P2INCH]  114.3,59.69 180 top
R101  10k  [R_P2INCH]  81.28,69.22 0 top
R102  10k  [R_P2INCH]  81.28,71.12 180 top
R103  10k  [R_P2INCH]  96.52,69.22 0 top
R104  10k  [R_P2INCH]  96.52,71.12 0 top
R105  470  [R_P2INCH]  88.9,59.69 180 top
R106  10k  [R_P2INCH]  55.88,69.22 0 top
R107  10k  [R_P2INCH]  55.88,71.12 180 top
R108  10k  [R_P2INCH]  71.12,69.22 0 top
R109  10k  [R_P2INCH]  71.12,71.12 0 top
R110  470  [R_P2INCH]  63.5,59.69 180 top
R111  10k  [R_P2INCH]  30.48,69.22 0 top
R112  10k  [R_P2INCH]  30.48,71.12 180 top
R113  10k  [R_P2INCH]  45.72,69.22 0 top
R114  10k  [R_P2INCH]  45.72,71.12 0 top
R115  470  [R_P2INCH]  38.1,59.69 180 top
R116  10k  [R_P2INCH]  5.08,69.22 0 top
R117  10k  [R_P2INCH]  5.08,71.12 180 top
R118  10k  [R_P2INCH]  20.32,69.22 0 top
R119  10k  [R_P2INCH]  20.32,71.12 0 top
R120  470  [R_P2INCH]  12.7,59.69 180 top
R121  10k  [R_P2INCH]  182.88,94.61 0 top
R122  10k  [R_P2INCH]  182.88,96.52 180 top
R123  10k  [R_P2INCH]  198.12,94.61 0 top
R124  10k  [R_P2INCH]  198.12,96.52 0 top
R125  470  [R_P2INCH]  190.5,85.09 180 top
R126  10k  [R_P2INCH]  157.48,94.61 0 top
R127  10k  [R_P2INCH]  157.48,96.52 180 top
R128  10k  [R_P2INCH]  172.72,94.61 0 top
R129  10k  [R_P2INCH]  172.72,96.52 0 top
R130  470  [R_P2INCH]  165.1,85.09 180 top
R131  10k  [R_P2INCH]  132.08,94.61 0 top
R132  10k  [R_P2INCH]  132.08,96.52 180 top
R133  10k  [R_P2INCH]  147.32,94.61 0 top
R134  10k  [R_P2INCH]  147.32,96.52 0 top
R135  470  [R_P2INCH]  139.7,85.09 180 top
R136  10k  [R_P2INCH]  106.68,94.61 0 top
R137  10k  [R_P2INCH]  106.68,96.52 180 top
R138  10k  [R_P2INCH]  121.92,94.61 0 top
R139  10k  [R_P2INCH]  121.92,96.52 0 top
R140  470  [R_P2INCH]  114.3,85.09 180 top
R141  10k  [R_P2INCH]  81.28,94.61 0 top
R142  10k  [R_P2INCH]  81.28,96.52 180 top
R143  10k  [R_P2INCH]  96.52,94.61 0 top
R144  10k  [R_P2INCH]  96.52,96.52 0 top
R145  470  [R_P2INCH]  88.9,85.09 180 top
R146  10k  [R_P2INCH]  55.88,94.61 0 top
R147  10k  [R_P2INCH]  55.88,96.52 180 top
R148  10k  [R_P2INCH]  71.12,94.61 0 top
R149  10k  [R_P2INCH]  71.12,96.52 0 top
R150  470  [R_P2INCH]  63.5,85.09 180 top
R151  10k  [R_P2INCH]  30.48,94.61 0 top
R152  10k  [R_P2INCH]  30.48,96.52 180 top
R153  10k  [R_P2INCH]  45.72,94.61 0 top
R154  10k  [R_P2INCH]  45.72,96.52 0 top
R155  470  [R_P2INCH]  38.1,85.09 180 top
R156  10k  [R_P2INCH]  5.08,94.61 0 top
R157  10k  [R_P2INCH]  5.08,96.52 180 top
R158  10k  [R_P2INCH]  20.32,94.61 0 top
R159  10k  [R_P2INCH]  20.32,96.52 0 top
R160  470  [R_P2INCH]  12.7,85.09 180 top
R161  10k  [R_P2INCH]  182.88,120.02 0 top
R162  10k  [R_P2INCH]  182.88,121.92 180 top
R163  10k  [R_P2INCH]  198.12,120.02 0 top
R164  10k  [R_P2INCH]  198.12,121.92 0 top
R165  470  [R_P2INCH]  190.5,110.49 180 top
R166  10k  [R_P2INCH]  157.48,120.02 0 top
R167  10k  [R_P2INCH]  157.48,121.92 180 top
R168  10k  [R_P2INCH]  172.72,120.02 0 top
R169  10k  [R_P2INCH]  172.72,121.92 0 top
R170  470  [R_P2INCH]  165.1,110.49 180 top
R171  10k  [R_P2INCH]  132.08,120.02 0 top
R172  10k  [R_P2INCH]  132.08,121.92 180 top
R173  10k  [R_P2INCH]  147.32,120.02 0 top
R174  10k  [R_P2INCH]  147.32,121.92 0 top
R175  470  [R_P2INCH]  139.7,110.49 180 top
R176  10k  [R_P2INCH]  106.68,120.02 0 top
R177  10k  [R_P2INCH]  106.68,121.92 180 top
R178  10k  [R_P2INCH]  121.92,120.02 0 top
R179  10k  [R_P2INCH]  121.92,121.92 0 top
R180  470  [R_P2INCH]  114.3,110.49 180 top
R181  10k  [R_P2INCH]  81.28,120.02 0 top
R182  10k  [R_P2INCH]  81.28,121.92 180 top
R183  10k  [R_P2INCH]  96.52,120.02 0 top
R184  10k  [R_P2INCH]  96.52,121.92 0 top
R185  470  [R_P2INCH]  88.9,110.49 180 top
R186  10k  [R_P2INCH]  55.88,120.02 0 top
R187  10k  [R_P2INCH]  55.88,121.92 180 top
R188  10k  [R_P2INCH]  71.12,120.02 0 top
R189  10k  [R_P2INCH]  71.12,121.92 0 top
R190  470  [R_P2INCH]  63.5,110.49 180 top
R191  10k  [R_P2INCH]  30.48,120.02 0 top
R192  10k  [R_P2INCH]  30.48,121.92 180 top
R193  10k  [R_P2INCH]  45.72,120.02 0 top
R194  10k  [R_P2INCH]  45.72,121.92 0 top
R195  470  [R_P2INCH]  38.1,110.49 180 top
R196  10k  [R_P2INCH]  5.08,120.02 0 top
R197  10k  [R_P2INCH]  5.08,121.92 180 top
R198  10k  [R_P2INCH]  20.32,120.02 0 top
R199  10k  [R_P2INCH]  20.32,121.92 0 top
R200  470  [R_P2INCH]  12.7,110.49 180 top
R201  10k  [R_P2INCH]  182.88,145.41 0 top
R202  10k  [R_P2INCH]  182.88,147.32 180 top
R203  10k  [R_P2INCH]  198.12,145.41 0 top
R204  10k  [R_P2INCH]  198.12,147.32 0 top
R205  470  [R_P2INCH]  190.5,135.89 180 top
R206  10k  [R_P2INCH]  157.48,145.41 0 top
R207  10k  [R_P2INCH]  157.48,147.32 180 top
R208  10k  [R_P2INCH]  172.72,145.41 0 top
R209  10k  [R_P2INCH]  172.72,147.32 0 top
R210  470  [R_P2INCH]  165.1,135.89 180 top
R211  10k  [R_P2INCH]  132.08,145.41 0 top
R212  10k  [R_P2INCH]  132.08,147.32 180 top
R213  10k  [R_P2INCH]  147.32,145.41 0 top
R214  10k  [R_P2INCH]  147.32,147.32 0 top
R215  470  [R_P2INCH]  139.7,135.89 180 top
R216  10k  [R_P2INCH]  106.68,145.41 0 top
R217  10k  [R_P2INCH]  106.68,147.32 180 top
R218  10k  [R_P2INCH]  121.92,145.41 0 top
R219  10k  [R_P2INCH]  121.92,147.32 0 top
R220  470  [R_P2INCH]  114.3,135.89 180 top
R221  10k  [R_P2INCH]  81.28,145.41 0 top
R222  10k  [R_P2INCH]  81.28,147.32 180 top
R223  10k  [R_P2INCH]  96.52,145.41 0 top
R224  10k  [R_P2INCH]  96.52,147.32 0 top
R225  470  [R_P2INCH]  88.9,135.89 180 top
R226  10k  [R_P2INCH]  55.88,145.41 0 top
R227  10k  [R_P2INCH]  55.88,147.32 180 top
R228  10k  [R_P2INCH]  71.12,145.41 0 top
R229  10k  [R_P2INCH]  71.12,147.32 0 top
R230  470  [R_P2INCH]  63.5,135.89 180 top
R231  10k  [R_P2INCH]  30.48,145.41 0 top
R232  10k  [R_P2INCH]  30.48,147.32 180 top